# EAGLE design Main.autotest (EAGLE 7.6.0)
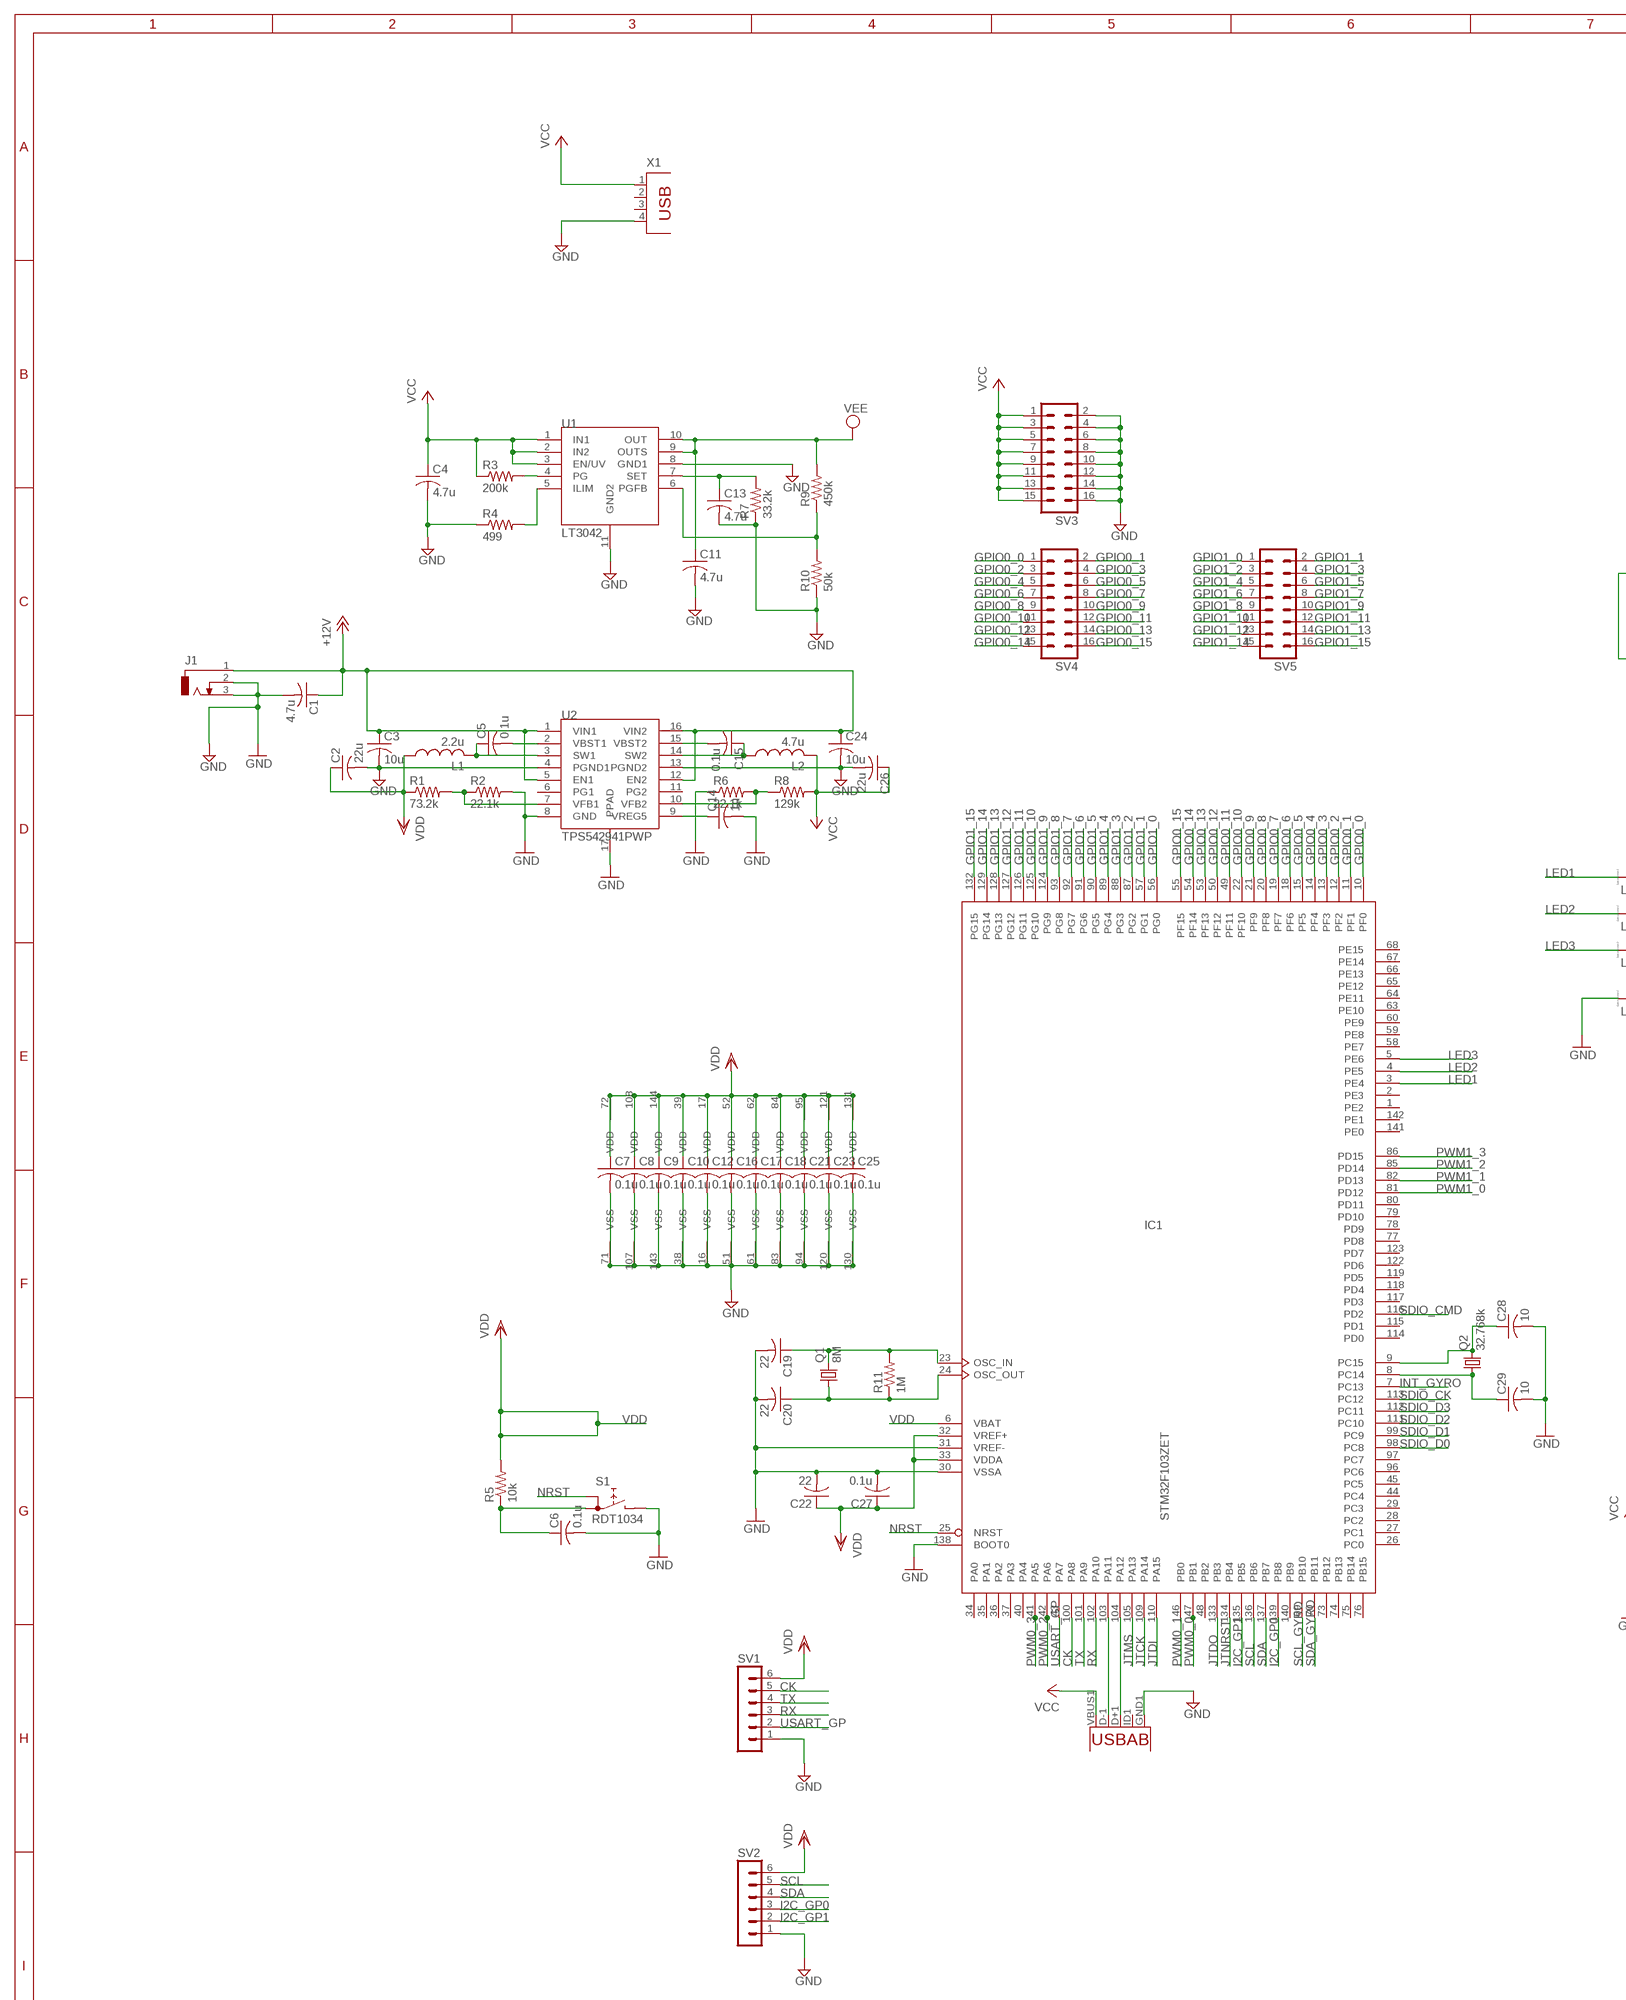
[diagram p0: schematic, sheet 1, part 1 of 2]
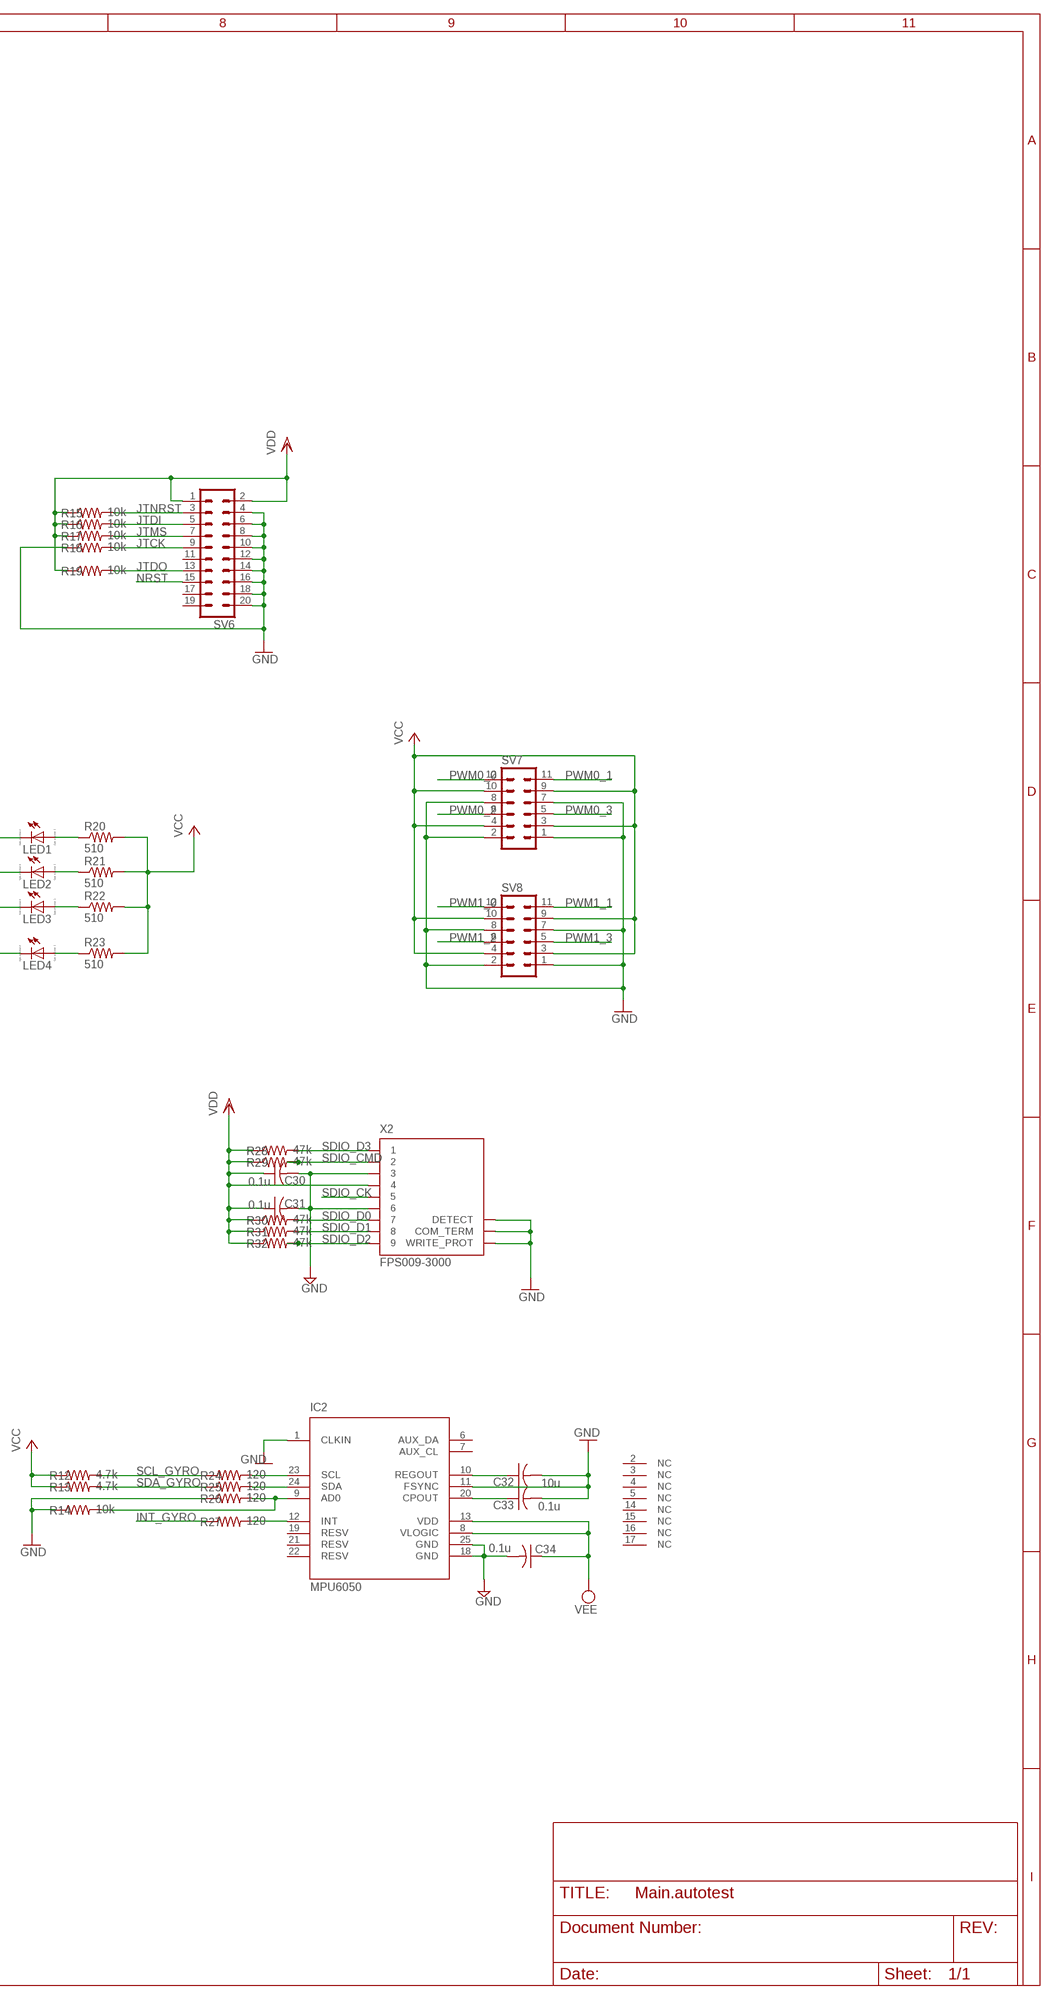
[diagram p1: schematic, sheet 1, part 2 of 2]

## Parts
C1  4.7u  C-USC1206  [C1206]
C2  22u  C-USC0603  [C0603]
C3  10u  C-USC0603  [C0603]
C4  4.7u  C-USC0603  [C0603]
C5  0.1u  C-USC0603  [C0603]
C6  0.1u  C-USC0603  [C0603]
C7  0.1u  C-USC0603  [C0603]
C8  0.1u  C-USC0603  [C0603]
C9  0.1u  C-USC0603  [C0603]
C10  0.1u  C-USC0603  [C0603]
C11  4.7u  C-USC0603  [C0603]
C12  0.1u  C-USC0603  [C0603]
C13  4.7u  C-USC0603  [C0603]
C14  1u  C-USC0603  [C0603]
C15  0.1u  C-USC0603  [C0603]
C16  0.1u  C-USC0603  [C0603]
C17  0.1u  C-USC0603  [C0603]
C18  0.1u  C-USC0603  [C0603]
C19  22  C-USC0603  [C0603]
C20  22  C-USC0603  [C0603]
C21  0.1u  C-USC0603  [C0603]
C22  22  C-USC0603  [C0603]
C23  0.1u  C-USC0603  [C0603]
C24  10u  C-USC0603  [C0603]
C25  0.1u  C-USC0603  [C0603]
C26  22u  C-USC0603  [C0603]
C27  0.1u  C-USC0603  [C0603]
C28  10  C-USC0603  [C0603]
C29  10  C-USC0603  [C0603]
C30  0.1u  C-USC0603  [C0603]
C31  0.1u  C-USC0603  [C0603]
C32  10u  C-USC0603  [C0603]
C33  0.1u  C-USC0603  [C0603]
C34  0.1u  C-USC0603  [C0603]
IC1  STM32F103ZET  [LQFP144]
IC2  MPU6050  [QFN50P400X400X95-25T265X275N]
J1  DCJ0303  [DCJ0303]
L1  2.2u  L-USL1812  [L1812]
L2  4.7u  L-USL1812  [L1812]
LED1  LED_E  [LED_1206]
LED2  LED_E  [LED_1206]
LED3  LED_E  [LED_1206]
LED4  LED_E  [LED_1206]
Q1  8M  CRYSTALHC49UP  [HC49UP]
Q2  32.768k  CRYSTALHC49UP  [HC49UP]
R1  73.2k  R-US_R1206  [R1206]
R2  22.1k  R-US_R1206  [R1206]
R3  200k  R-US_R0603  [R0603]
R4  499  R-US_R0603  [R0603]
R5  10k  R-US_R0603  [R0603]
R6  22.1k  R-US_R1206  [R1206]
R7  33.2k  R-US_R0603  [R0603]
R8  129k  R-US_R1206  [R1206]
R9  450k  R-US_R0603  [R0603]
R10  50k  R-US_R0603  [R0603]
R11  1M  R-US_R0603  [R0603]
R12  4.7k  R-US_R0603  [R0603]
R13  4.7k  R-US_R0603  [R0603]
R14  10k  R-US_R0603  [R0603]
R15  10k  R-US_R0603  [R0603]
R16  10k  R-US_R0603  [R0603]
R17  10k  R-US_R0603  [R0603]
R18  10k  R-US_R0603  [R0603]
R19  10k  R-US_R0603  [R0603]
R20  510  R-US_R0603  [R0603]
R21  510  R-US_R0603  [R0603]
R22  510  R-US_R0603  [R0603]
R23  510  R-US_R0603  [R0603]
R24  120  R-US_R0603  [R0603]
R25  120  R-US_R0603  [R0603]
R26  120  R-US_R0603  [R0603]
R27  120  R-US_R0603  [R0603]
R28  47k  R-US_R0603  [R0603]
R29  47k  R-US_R0603  [R0603]
R30  47k  R-US_R0603  [R0603]
R31  47k  R-US_R0603  [R0603]
R32  47k  R-US_R0603  [R0603]
S1  RDT1034  [RDT1034]
SV1  MA06-1  [MA06-1]
SV2  MA06-1  [MA06-1]
SV3  MA08-2  [MA08-2]
SV4  MA08-2  [MA08-2]
SV5  MA08-2  [MA08-2]
SV6  MA10-2  [MA10-2]
SV7  MA06-2  [MA06-2]
SV8  MA06-2  [MA06-2]
U1  LT3042  [LT3042]
U2  TPS542941PWP  [HTSSOP16]
U3  USB""  [USB-MICRO-SMD]
X1  PN87520  [PN87520]
X2  FPS009-3000  [FPS009-3000]

## Nets
+12V: C1.1 C3.1 C24.1 J1.1 U2.1(VIN1) U2.5(EN1) U2.12(EN2) U2.16(VIN2)
CK: IC1.100(PA8) SV1.5
GND: C1.2 C2.2 C3.2 C4.2 C6.2 C7.2 C8.2 C9.2 C10.2 C11.2 C12.2 C13.2 C14.2 C16.2 C17.2 C18.2 C19.2 C20.2 C21.2 C22.2 C23.2 C24.2 C25.2 C26.2 C27.2 C28.2 C29.2 C30.2 C31.2 C32.2 C33.2 C34.2 IC1.16(VSS) IC1.30(VSSA) IC1.31(VREF-) IC1.38(VSS) IC1.51(VSS) IC1.61(VSS) IC1.71(VSS) IC1.83(VSS) IC1.94(VSS) IC1.107(VSS) IC1.120(VSS) IC1.130(VSS) IC1.138(BOOT0) IC1.143(VSS) IC2.1(CLKIN) IC2.11(FSYNC) IC2.18(GND) IC2.25(GND) J1.2 J1.3 LED4.C R2.2 R4.1 R6.1 R7.1 R10.1 R14.1 R18.1 R26.1 S1.B SV1.1 SV2.1 SV3.2 SV3.4 SV3.6 SV3.8 SV3.10 SV3.12 SV3.14 SV3.16 SV6.4 SV6.6 SV6.8 SV6.10 SV6.12 SV6.14 SV6.16 SV6.18 SV6.20 SV7.1 SV7.2 SV7.7 SV7.8 SV8.1 SV8.2 SV8.7 SV8.8 U1.8(GND1) U1.11(GND2) U2.4(PGND1) U2.8(GND) U2.13(PGND2) U2.17(PPAD) U3.GND1(GND) X1.4 X2.3 X2.6 X2.COM_TERM X2.DETECT X2.WRITE_PROT
GPIO0_0: IC1.10(PF0) SV4.1
GPIO0_1: IC1.11(PF1) SV4.2
GPIO0_2: IC1.12(PF2) SV4.3
GPIO0_3: IC1.13(PF3) SV4.4
GPIO0_4: IC1.14(PF4) SV4.5
GPIO0_5: IC1.15(PF5) SV4.6
GPIO0_6: IC1.18(PF6) SV4.7
GPIO0_7: IC1.19(PF7) SV4.8
GPIO0_8: IC1.20(PF8) SV4.9
GPIO0_9: IC1.21(PF9) SV4.10
GPIO0_10: IC1.22(PF10) SV4.11
GPIO0_11: IC1.49(PF11) SV4.12
GPIO0_12: IC1.50(PF12) SV4.13
GPIO0_13: IC1.53(PF13) SV4.14
GPIO0_14: IC1.54(PF14) SV4.15
GPIO0_15: IC1.55(PF15) SV4.16
GPIO1_0: IC1.56(PG0) SV5.1
GPIO1_1: IC1.57(PG1) SV5.2
GPIO1_2: IC1.87(PG2) SV5.3
GPIO1_3: IC1.88(PG3) SV5.4
GPIO1_4: IC1.89(PG4) SV5.5
GPIO1_5: IC1.90(PG5) SV5.6
GPIO1_6: IC1.91(PG6) SV5.7
GPIO1_7: IC1.92(PG7) SV5.8
GPIO1_8: IC1.93(PG8) SV5.9
GPIO1_9: IC1.124(PG9) SV5.10
GPIO1_10: IC1.125(PG10) SV5.11
GPIO1_11: IC1.126(PG11) SV5.12
GPIO1_12: IC1.127(PG12) SV5.13
GPIO1_13: IC1.128(PG13) SV5.14
GPIO1_14: IC1.129(PG14) SV5.15
GPIO1_15: IC1.132(PG15) SV5.16
I2C_GP0: IC1.139(PB8) SV2.3
I2C_GP1: IC1.135(PB5) SV2.2
INT_GYRO: IC1.7(PC13) R27.1
JTCK: IC1.109(PA14) R18.2 SV6.9
JTDI: IC1.110(PA15) R16.2 SV6.5
JTDO: IC1.133(PB3) R19.2 SV6.13
JTMS: IC1.105(PA13) R17.2 SV6.7
JTNRST: IC1.134(PB4) R15.2 SV6.3
LED1: IC1.3(PE4) LED1.C
LED2: IC1.4(PE5) LED2.C
LED3: IC1.5(PE6) LED3.C
N$1: C19.1 IC1.23(OSC_IN) Q1.2 R11.2
N$2: C20.1 IC1.24(OSC_OUT) Q1.1 R11.1
N$3: IC1.103(PA11) U3.D-1(D-)
N$4: C29.1 IC1.8(PC14) Q2.1
N$5: C28.1 IC1.9(PC15) Q2.2
N$6: IC1.104(PA12) U3.D+1(D+)
N$7: C6.1 R5.1 S1.A1
N$8: LED4.A R23.1
N$9: LED1.A R20.1
N$10: IC2.23(SCL) R24.2
N$12: IC2.24(SDA) R25.2
N$13: LED2.A R21.1
N$14: C5.2 U2.2(VBST1)
N$15: IC2.12(INT) R27.2
N$16: C32.1 IC2.10(REGOUT)
N$17: C33.1 IC2.20(CPOUT)
N$18: IC2.9(AD0) R14.2 R26.2
N$19: LED3.A R22.1
N$20: C15.2 U2.15(VBST2)
N$21: C5.1 L1.2 U2.3(SW1)
N$22: R3.2 U1.4(PG)
N$23: C15.1 L2.1 U2.14(SW2)
N$24: R4.2 U1.5(ILIM)
N$25: R9.1 R10.2 U1.6(PGFB)
N$26: R1.2 R2.1 U2.7(VFB1)
N$27: C13.1 R7.2 U1.7(SET)
N$28: R6.2 R8.1 U2.10(VFB2)
N$30: C14.1 U2.9(VREG5)
NRST: IC1.25(NRST) S1.A SV6.15
PWM0_0: IC1.47(PB1) SV7.12
PWM0_1: IC1.46(PB0) SV7.11
PWM0_2: IC1.42(PA6) SV7.6
PWM0_3: IC1.41(PA5) SV7.5
PWM1_0: IC1.81(PD12) SV8.12
PWM1_1: IC1.82(PD13) SV8.11
PWM1_2: IC1.85(PD14) SV8.6
PWM1_3: IC1.86(PD15) SV8.5
RX: IC1.102(PA10) SV1.3
SCL: IC1.136(PB6) SV2.5
SCL_GYRO: IC1.69(PB10) R12.2 R24.1
SDA: IC1.137(PB7) SV2.4
SDA_GYRO: IC1.70(PB11) R13.2 R25.1
SDIO_CK: IC1.113(PC12) X2.5
SDIO_CMD: IC1.116(PD2) R29.2 X2.2
SDIO_D0: IC1.98(PC8) R30.2 X2.7
SDIO_D1: IC1.99(PC9) R31.2 X2.8
SDIO_D2: IC1.111(PC10) R32.2 X2.9
SDIO_D3: IC1.112(PC11) R28.2 X2.1
TX: IC1.101(PA9) SV1.4
USART_GP: IC1.43(PA7) SV1.2
VCC: C4.1 C26.1 L2.2 R3.1 R8.2 R12.1 R13.1 R20.2 R21.2 R22.2 R23.2 SV3.1 SV3.3 SV3.5 SV3.7 SV3.9 SV3.11 SV3.13 SV3.15 SV7.3 SV7.4 SV7.9 SV7.10 SV8.3 SV8.4 SV8.9 SV8.10 U1.1(IN1) U1.2(IN2) U1.3(EN/UV) U3.VBUS1(VBUS) X1.1
VDD: C2.1 C7.1 C8.1 C9.1 C10.1 C12.1 C16.1 C17.1 C18.1 C21.1 C22.1 C23.1 C25.1 C27.1 C30.1 C31.1 IC1.6(VBAT) IC1.17(VDD) IC1.32(VREF+) IC1.33(VDDA) IC1.39(VDD) IC1.52(VDD) IC1.62(VDD) IC1.72(VDD) IC1.84(VDD) IC1.95(VDD) IC1.108(VDD) IC1.121(VDD) IC1.131(VDD) IC1.144(VDD) L1.1 R1.1 R5.2 R15.1 R16.1 R17.1 R19.1 R28.1 R29.1 R30.1 R31.1 R32.1 SV1.6 SV2.6 SV6.1 SV6.2 X2.4
VEE: C11.1 C34.1 IC2.8(VLOGIC) IC2.13(VDD) R9.2 U1.9(OUTS) U1.10(OUT)
Unconnected: IC1.1(PE2) IC1.2(PE3) IC1.26(PC0) IC1.27(PC1) IC1.28(PC2) IC1.29(PC3) IC1.34(PA0) IC1.35(PA1) IC1.36(PA2) IC1.37(PA3) IC1.40(PA4) IC1.44(PC4) IC1.45(PC5) IC1.48(PB2) IC1.58(PE7) IC1.59(PE8) IC1.60(PE9) IC1.63(PE10) IC1.64(PE11) IC1.65(PE12) IC1.66(PE13) IC1.67(PE14) IC1.68(PE15) IC1.73(PB12) IC1.74(PB13) IC1.75(PB14) IC1.76(PB15) IC1.77(PD8) IC1.78(PD9) IC1.79(PD10) IC1.80(PD11) IC1.96(PC6) IC1.97(PC7) IC1.114(PD0) IC1.115(PD1) IC1.117(PD3) IC1.118(PD4) IC1.119(PD5) IC1.122(PD6) IC1.123(PD7) IC1.140(PB9) IC1.141(PE0) IC1.142(PE1) IC2.2(NC) IC2.3(NC) IC2.4(NC) IC2.5(NC) IC2.6(AUX_DA) IC2.7(AUX_CL) IC2.14(NC) IC2.15(NC) IC2.16(NC) IC2.17(NC) IC2.19(RESV) IC2.21(RESV) IC2.22(RESV) SV6.11 SV6.17 SV6.19 U2.6(PG1) U2.11(PG2) U3.ID1(USBID) X1.2 X1.3

## Library data of the parts
C1-C34 = rcl:C-US: CAPACITOR, American symbol
IC1 = micro-stm_v3:STM32F103Z*T: ARM 32-bit Cortex™-M3 CPU 72 MHz maximum frequency 256 to 1024 Kbytes of Flash memory 48 to 96 kbytes of SRAM 112 GPIOs 2.0 to 3.6 V application supply
IC2 = invensense:MPU6050: The triple-axis MEMS gyroscope
J1 = con-jack:DCJ0303: DC POWER JACK Source: DCJ0303.pdf; OC_FARNELL: unknown; OC_NEWARK: unknown
L1 L2 = rcl:L-US: INDUCTOR, American symbol
LED1-LED4 = eagle-ltspice:LED_E: LED Source: http://www.osram.convergy.de Source: www.luxeon.com Source: www.kingbright.com; SPICEMODEL: NONE; SPICEPREFIX: D; SPICETYPE: diode
Q1 Q2 = crystal:CRYSTAL: CRYSTAL; OC_FARNELL: unknown; OC_NEWARK: unknown
R1-R14 R20-R32 = rcl:R-US_: RESISTOR, American symbol
R15-R19 = resistor:R-US_: RESISTOR, American symbol
S1 = switch:RDT1034: PUSH SWITCH www.radiohm.com
SV1 SV2 = con-lstb:MA06-1: PIN HEADER; OC_FARNELL: unknown; OC_NEWARK: unknown
SV3-SV5 = con-lstb:MA08-2: PIN HEADER; OC_FARNELL: unknown; OC_NEWARK: unknown
SV6 = con-lstb:MA10-2: PIN HEADER; OC_FARNELL: unknown; OC_NEWARK: unknown
SV7 SV8 = con-lstb:MA06-2: PIN HEADER; OC_FARNELL: unknown; OC_NEWARK: unknown
U1 = LT3042:LT3042
U2 = TPS542941:TPS542941PWP
U3 = MicroUSB:USB: This is a USB AB connector that is compatible with USB OTG. i.e. this connector can serve as a host or device
X1 = con-berg:PN87520: BERG USB connector; OC_FARNELL: unknown; OC_NEWARK: unknown
X2 = con-yamaichi:FPS009-300*: SD Card and MMC Reader (Manual Insertion) Source: http://www.yamaichi.de/pdf/c_fps009_3000.pdf; OC_FARNELL: unknown; OC_NEWARK: unknown

## Board
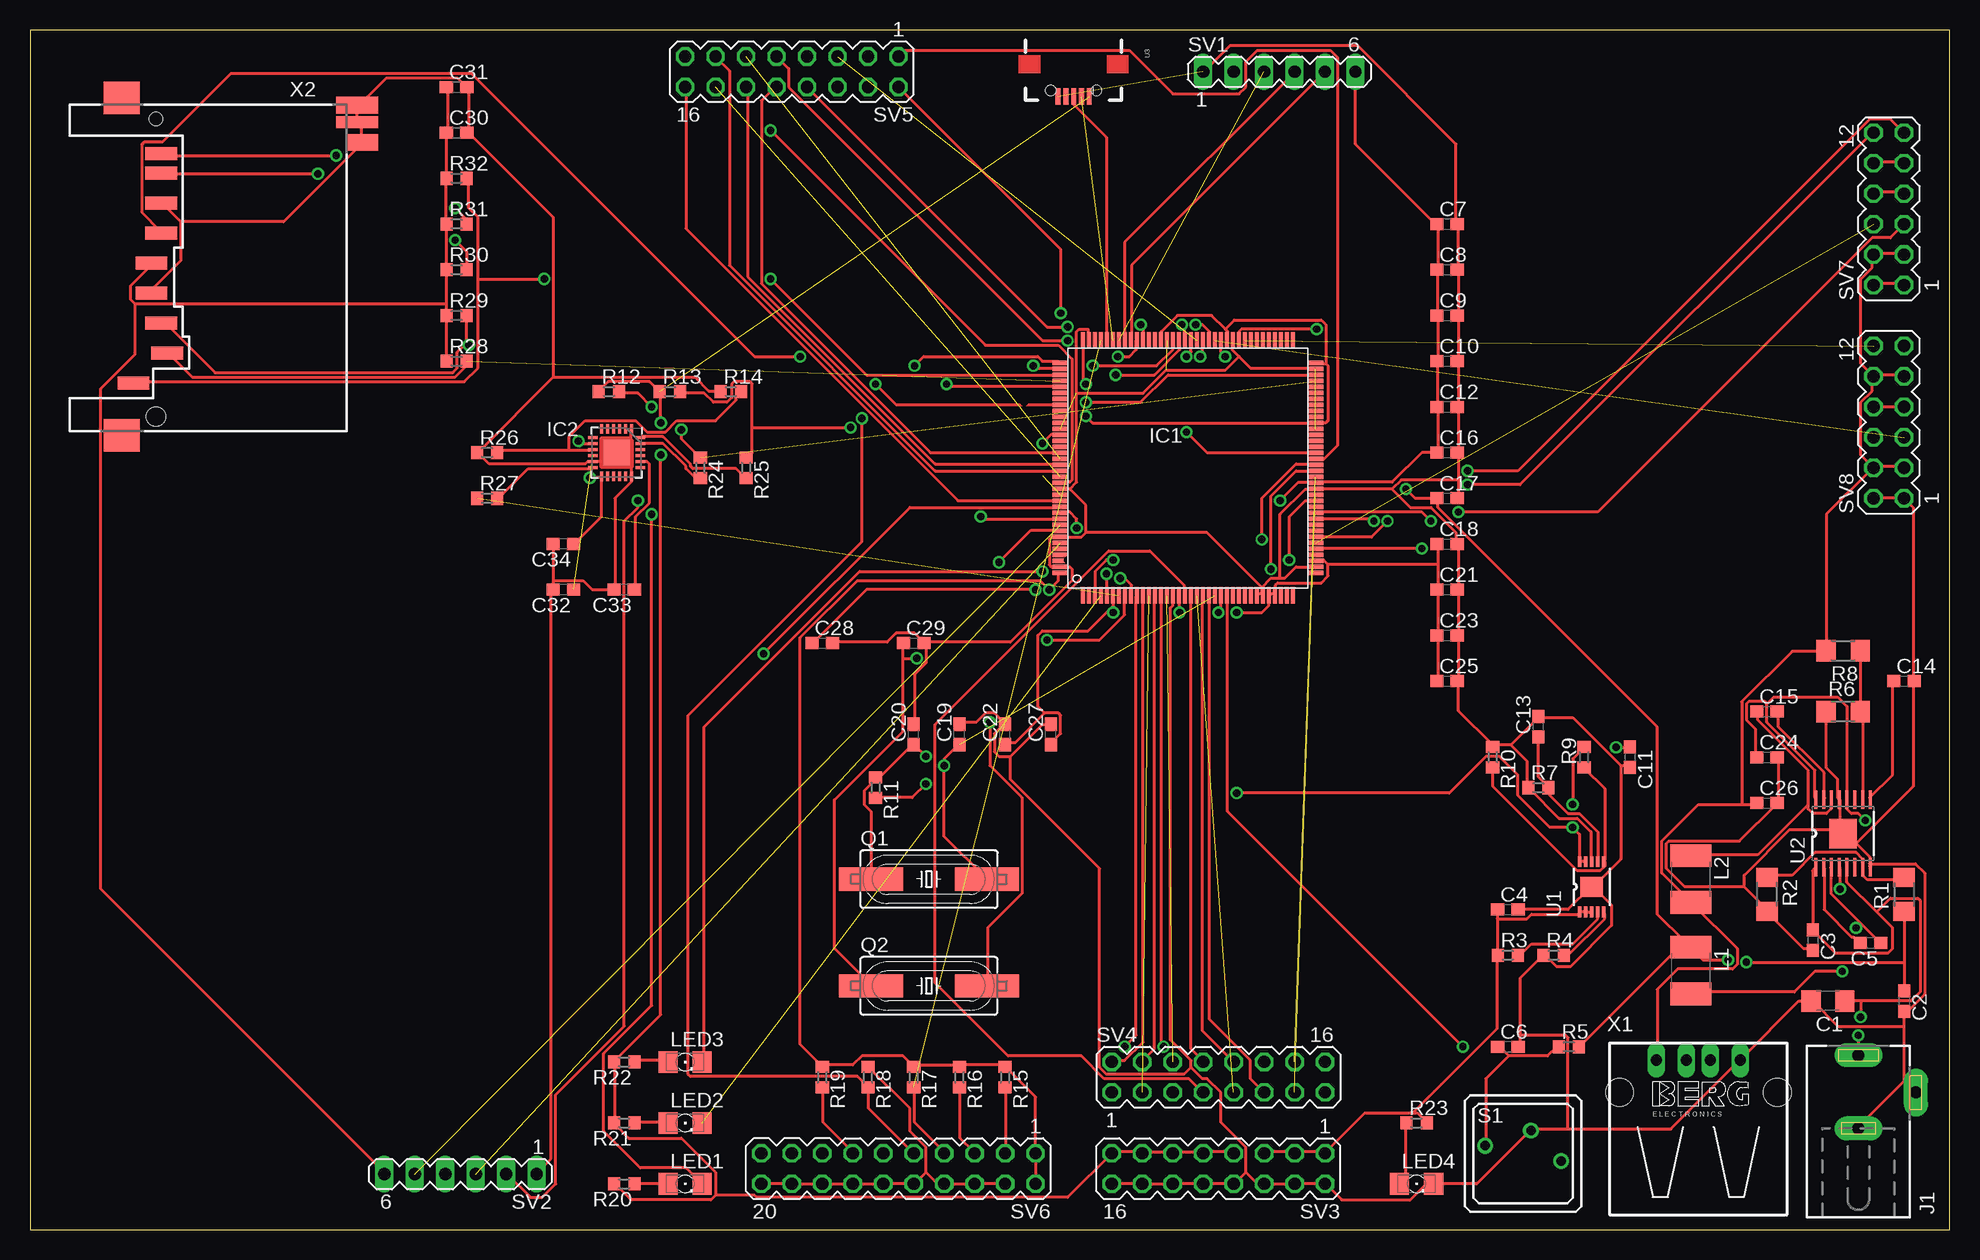
[diagram p2: board, top side]
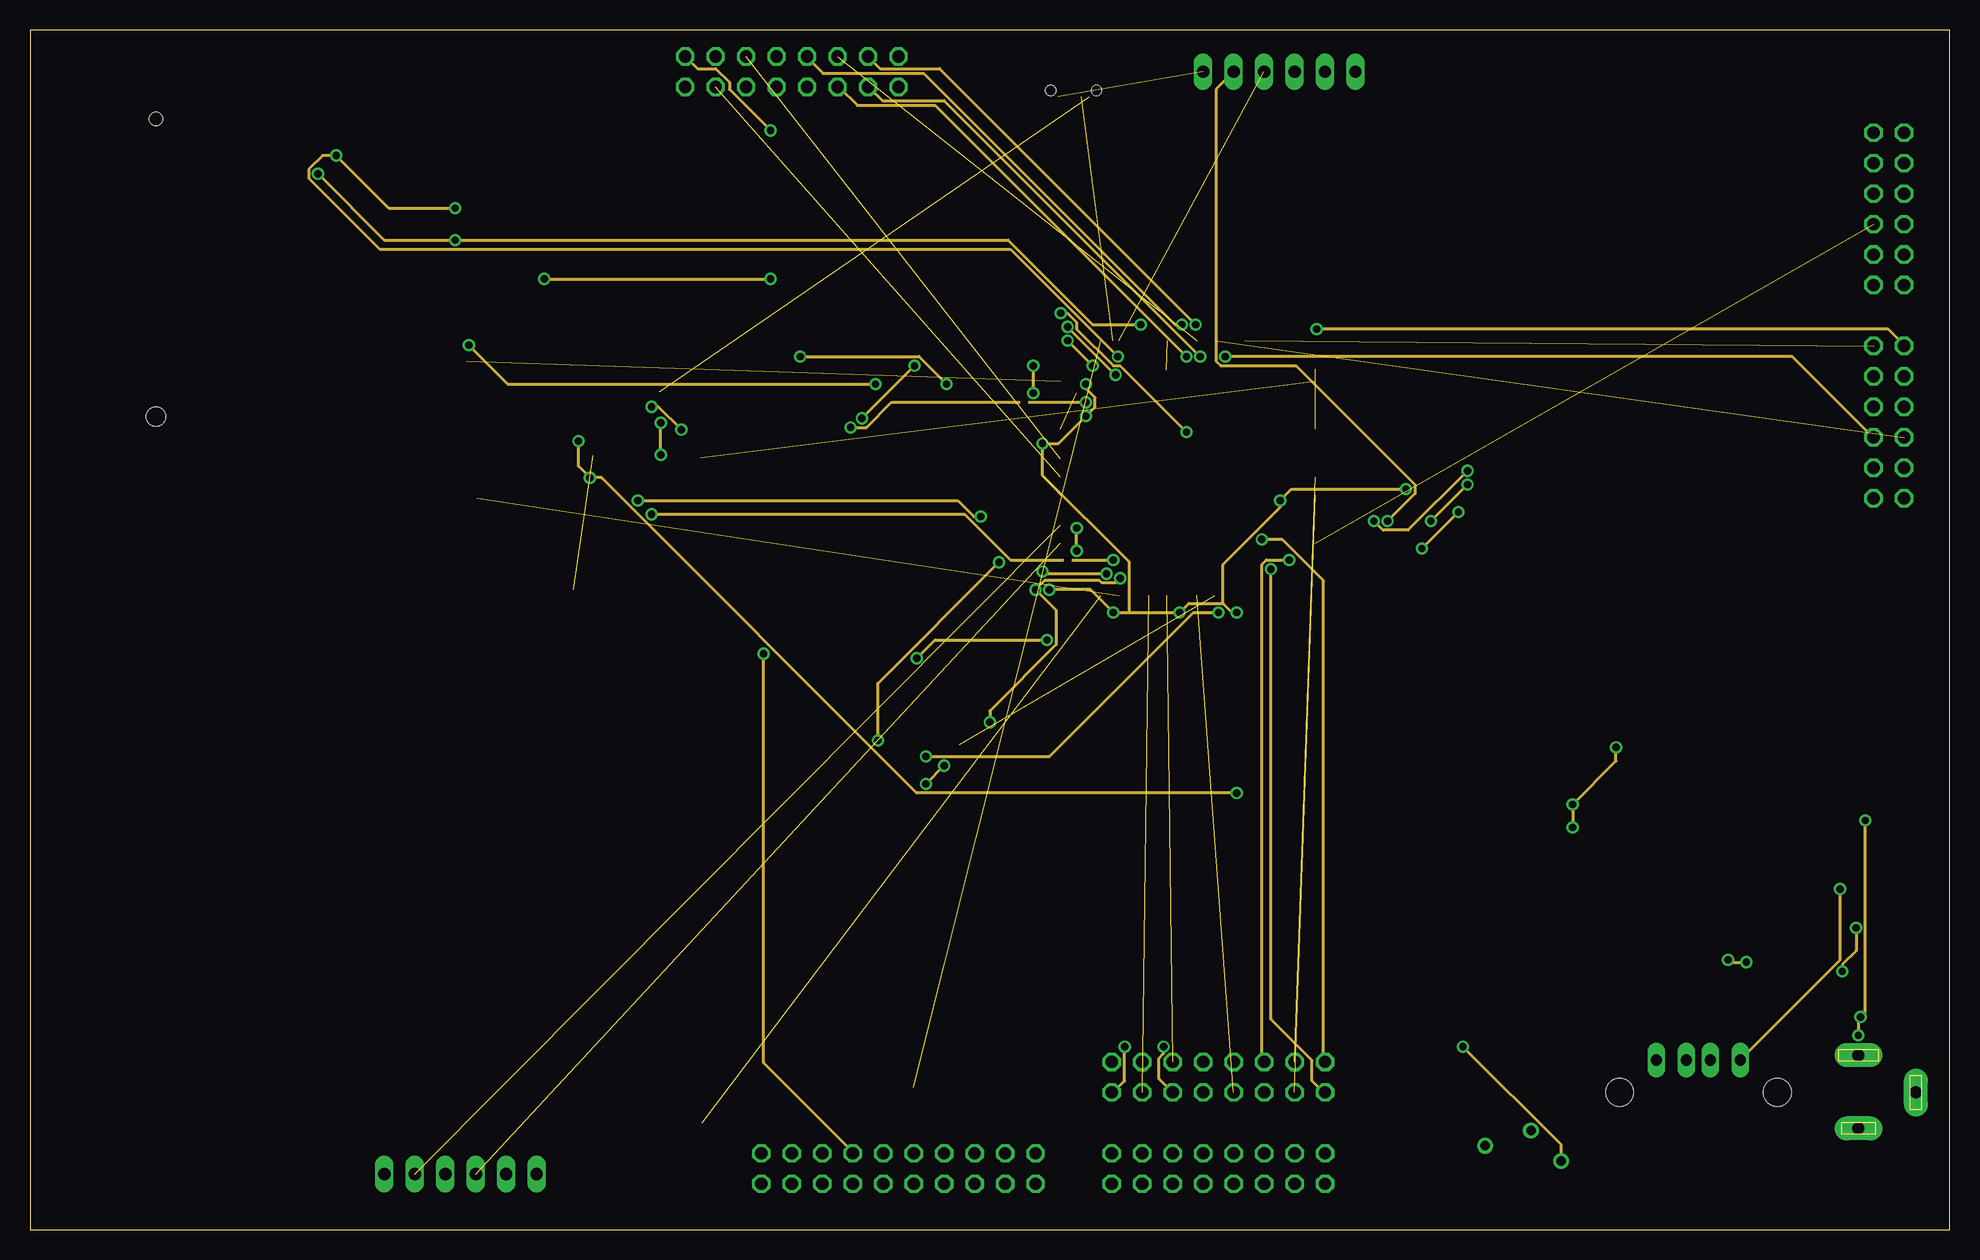
[diagram p3: board, inner layer $GND]
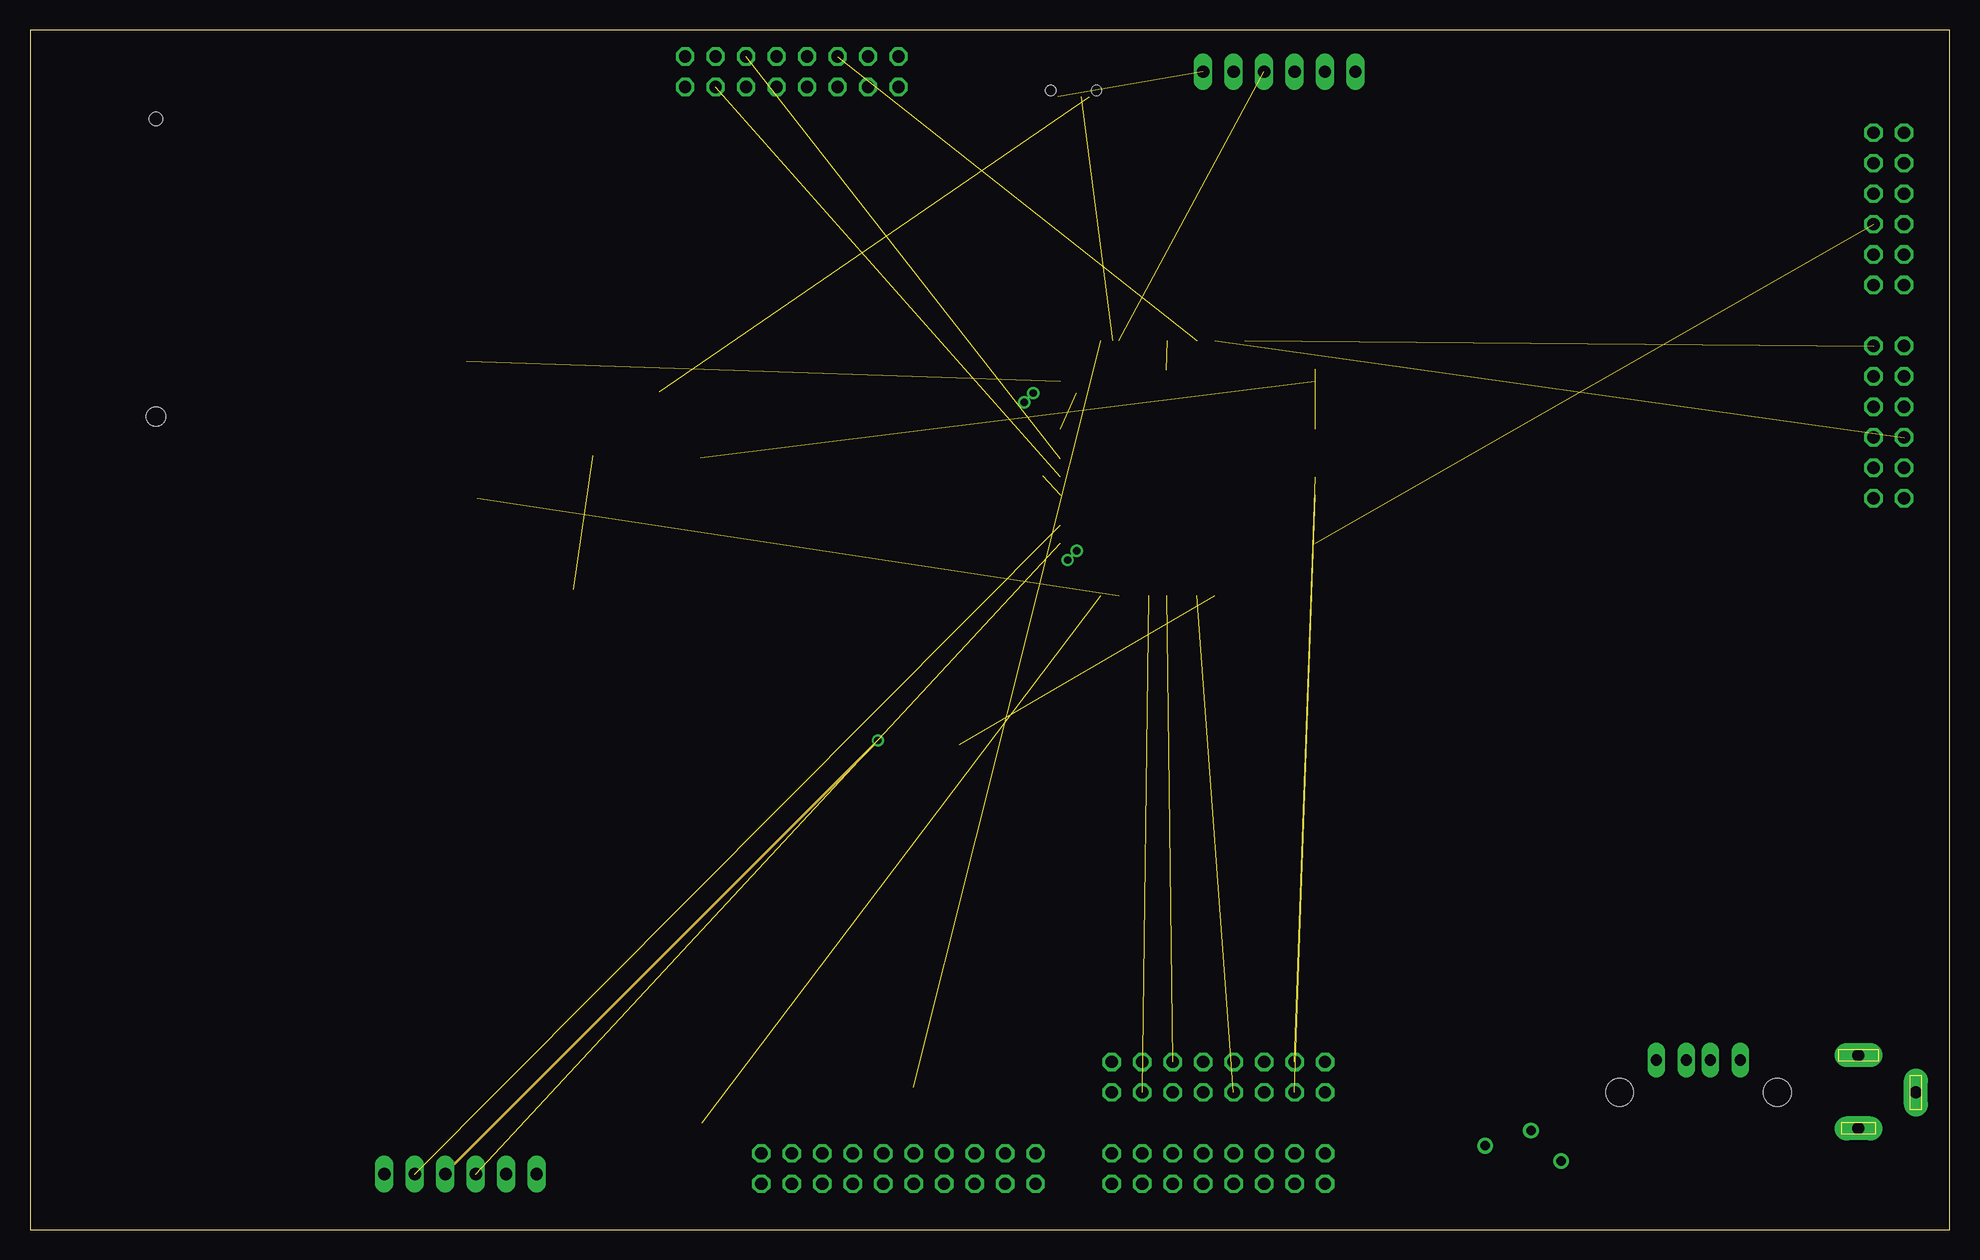
[diagram p4: board, inner layer $VDD]
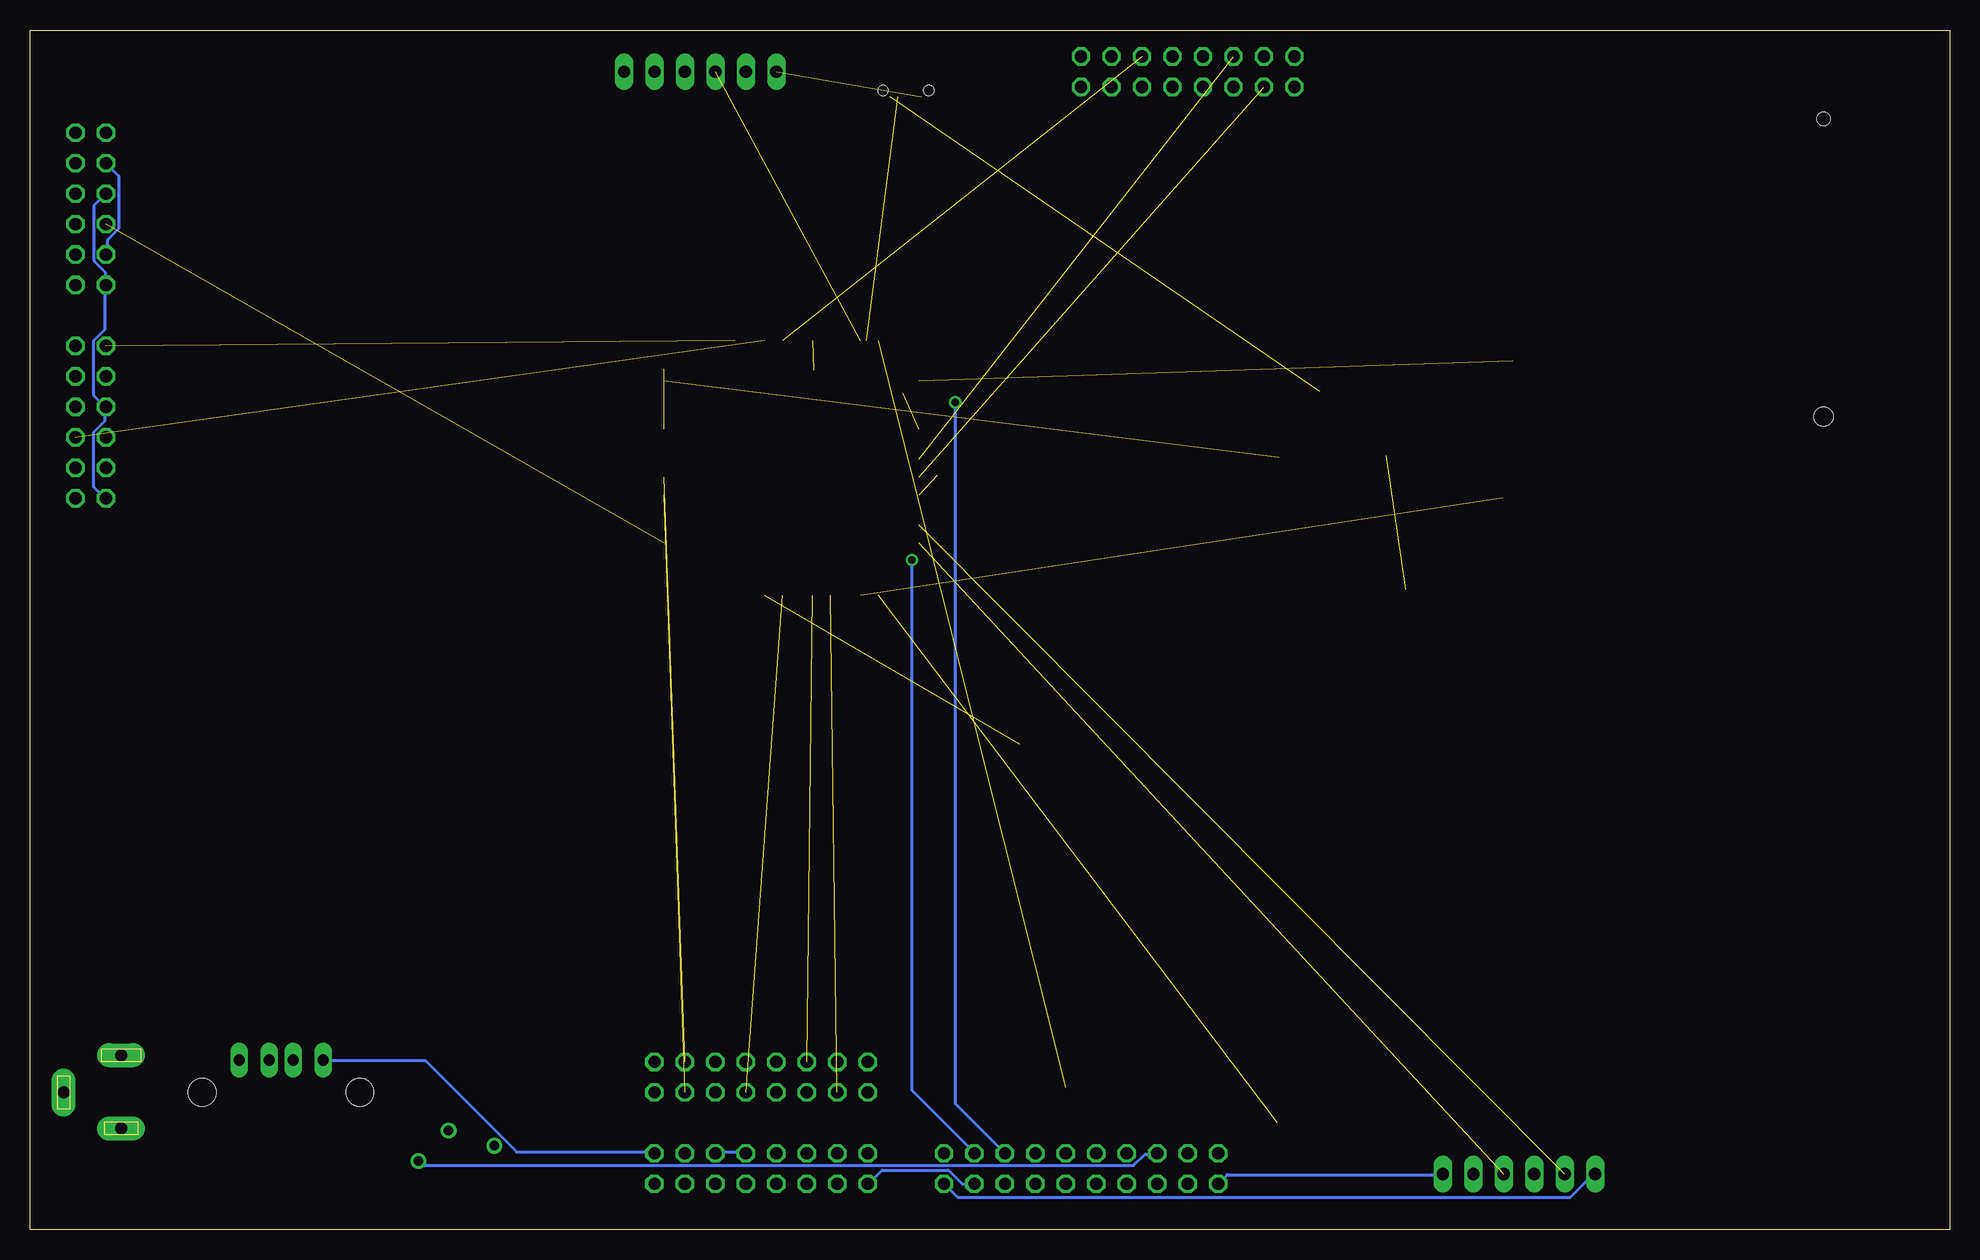
[diagram p5: board, bottom side, seen from below]

Size 160 x 100 mm. Coordinates in mm from the lower left corner, seen from the top.
Outline: 0,0 160,0 160,100 0,100 0,0
Copper layers [2:1*(2*15)*16:15]: Top 0.035mm / dielectric 0.5mm / $GND 0.035mm / dielectric 0.5mm / $VDD 0.035mm / dielectric 0.5mm / Bottom 0.035mm
Design rules "default *": minimum track width 10mil, minimum drill 24mil, track to track 5mil, track to pad 5mil, pad to pad 5mil, via to via 5mil, smd to smd 5mil, copper to edge 40mil, drill to drill 8mil, minimum pad ring 10mil, minimum via ring 8mil, stop-mask expansion 4mil, vias tented up to drill 0mil, thermal gap 10mil

### Footprints (pad centres in the part's own frame; a part is rotated, then mirrored left to right if it is on the bottom)
C1206 = smd 1.6 x 1.8: 1 -1.4,0; 2 1.4,0
C0603 = smd 1.1 x 1: 1 -0.85,0; 2 0.85,0
LQFP144 = smd 0.35 x 1.35: 1 -8.75,-10.625; 2 -8.25,-10.625; 3 -7.75,-10.625; 4 -7.25,-10.625; 5 -6.75,-10.625; 6 -6.25,-10.625; 7 -5.75,-10.625; 8 -5.25,-10.625; 9 -4.75,-10.625; 10 -4.25,-10.625; 11 -3.75,-10.625; 12 -3.25,-10.625; 13 -2.75,-10.62; 14 -2.25,-10.625; 15 -1.75,-10.625; 16 -1.25,-10.625; 17 -0.75,-10.625; 18 -0.25,-10.625; 19 0.25,-10.625; 20 0.75,-10.625; 21 1.25,-10.625; 22 1.75,-10.625; 23 2.25,-10.625; 24 2.75,-10.62; 25 3.25,-10.625; 26 3.75,-10.625; 27 4.25,-10.625; 28 4.75,-10.625; 29 5.25,-10.625; 30 5.75,-10.625; 31 6.25,-10.625; 32 6.75,-10.625; 33 7.25,-10.625; 34 7.75,-10.625; 35 8.25,-10.625; 36 8.75,-10.625; 73 8.75,10.625; 74 8.25,10.625; 75 7.75,10.625; 76 7.25,10.625; 77 6.75,10.625; 78 6.25,10.625; 79 5.75,10.625; 80 5.25,10.625; 81 4.75,10.625; 82 4.25,10.625; 83 3.75,10.625; 84 3.25,10.625; 85 2.75,10.625; 86 2.25,10.625; 87 1.75,10.625; 88 1.25,10.625; 89 0.75,10.625; 90 0.25,10.625; 91 -0.25,10.625; 92 -0.75,10.625; 93 -1.25,10.625; 94 -1.75,10.625; 95 -2.25,10.625; 96 -2.75,10.625; 97 -3.25,10.625; 98 -3.75,10.625; 99 -4.25,10.625; 100 -4.75,10.625; 101 -5.25,10.625; 102 -5.75,10.625; 103 -6.25,10.625; 104 -6.75,10.625; 105 -7.25,10.625; 106 -7.75,10.625; 107 -8.25,10.625; 108 -8.75,10.625 | smd 1.35 x 0.35: 37 10.625,-8.75; 38 10.625,-8.25; 39 10.625,-7.75; 40 10.625,-7.25; 41 10.625,-6.75; 42 10.625,-6.25; 43 10.625,-5.75; 44 10.625,-5.25; 45 10.625,-4.75; 46 10.625,-4.25; 47 10.625,-3.75; 48 10.625,-3.25; 49 10.625,-2.75; 50 10.625,-2.25; 51 10.625,-1.75; 52 10.625,-1.25; 53 10.625,-0.75; 54 10.625,-0.25; 55 10.625,0.25; 56 10.625,0.75; 57 10.625,1.25; 58 10.625,1.75; 59 10.625,2.25; 60 10.625,2.75; 61 10.625,3.25; 62 10.625,3.75; 63 10.625,4.25; 64 10.625,4.75; 65 10.625,5.25; 66 10.625,5.75; 67 10.625,6.25; 68 10.625,6.75; 69 10.625,7.25; 70 10.625,7.75; 71 10.625,8.25; 72 10.625,8.75; 109 -10.625,8.75; 110 -10.625,8.25; 111 -10.625,7.75; 112 -10.625,7.25; 113 -10.625,6.75; 114 -10.625,6.25; 115 -10.625,5.75; 116 -10.625,5.25; 117 -10.625,4.75; 118 -10.625,4.25; 119 -10.625,3.75; 120 -10.625,3.25; 121 -10.625,2.75; 122 -10.625,2.25; 123 -10.625,1.75; 124 -10.625,1.25; 125 -10.625,0.75; 126 -10.625,0.25; 127 -10.625,-0.25; 128 -10.625,-0.75; 129 -10.625,-1.25; 130 -10.625,-1.75; 131 -10.625,-2.25; 132 -10.625,-2.75; 133 -10.625,-3.25; 134 -10.625,-3.75; 135 -10.625,-4.25; 136 -10.625,-4.75; 137 -10.625,-5.25; 138 -10.625,-5.75; 139 -10.625,-6.25; 140 -10.625,-6.75; 141 -10.625,-7.25; 142 -10.625,-7.75; 143 -10.625,-8.25; 144 -10.625,-8.75
QFN50P400X400X95-25T265X275N = smd 0.26 x 0.79: 1 -1.25,-1.97; 2 -0.75,-1.97; 3 -0.25,-1.97; 4 0.25,-1.97; 5 0.75,-1.97; 6 1.25,-1.97; 13 1.25,1.97; 14 0.75,1.97; 15 0.25,1.97; 16 -0.25,1.97; 17 -0.75,1.97; 18 -1.25,1.97 | smd 0.79 x 0.26: 7 1.97,-1.25; 8 1.97,-0.75; 9 1.97,-0.25; 10 1.97,0.25; 11 1.97,0.75; 12 1.97,1.25; 19 -1.97,1.25; 20 -1.97,0.75; 21 -1.97,0.25; 22 -1.97,-0.25; 23 -1.97,-0.75; 24 -1.97,-1.25 | smd 2.15 x 2.05: 25 0,0
DCJ0303 = drill 1 pad 2 long: 1 0,3.1; 2 4.8,0; 3 0,-3
L1812 = smd 1.9 x 3.4: 1 -1.95,0; 2 1.95,0
LED_1206 = smd 1.6 x 1.803: A -1.422,0; C 1.422,0
HC49UP = smd 5.334 x 1.93: 1 -4.826,0; 2 4.826,0
R1206 = smd 1.6 x 1.803: 1 -1.422,0; 2 1.422,0
R0603 = smd 1 x 1.1: 1 -0.85,0; 2 0.85,0
RDT1034 = drill 0.8: A 3.175,-0.635; A1 -3.175,0.635; B 0.65,1.9
MA06-1 = drill 1.016 long: 1 -6.35,0; 2 -3.81,0; 3 -1.27,0; 4 1.27,0; 5 3.81,0; 6 6.35,0
MA08-2 = drill 1.016 octagon: 1 -8.89,-1.27; 2 -8.89,1.27; 3 -6.35,-1.27; 4 -6.35,1.27; 5 -3.81,-1.27; 6 -3.81,1.27; 7 -1.27,-1.27; 8 -1.27,1.27; 9 1.27,-1.27; 10 1.27,1.27; 11 3.81,-1.27; 12 3.81,1.27; 13 6.35,-1.27; 14 6.35,1.27; 15 8.89,-1.27; 16 8.89,1.27
MA10-2 = drill 1.016 octagon: 1 -11.43,-1.27; 2 -11.43,1.27; 3 -8.89,-1.27; 4 -8.89,1.27; 5 -6.35,-1.27; 6 -6.35,1.27; 7 -3.81,-1.27; 8 -3.81,1.27; 9 -1.27,-1.27; 10 -1.27,1.27; 11 1.27,-1.27; 12 1.27,1.27; 13 3.81,-1.27; 14 3.81,1.27; 15 6.35,-1.27; 16 6.35,1.27; 17 8.89,-1.27; 18 8.89,1.27; 19 11.43,-1.27; 20 11.43,1.27
MA06-2 = drill 1.016 octagon: 1 -6.35,-1.27; 2 -6.35,1.27; 3 -3.81,-1.27; 4 -3.81,1.27; 5 -1.27,-1.27; 6 -1.27,1.27; 7 1.27,-1.27; 8 1.27,1.27; 9 3.81,-1.27; 10 3.81,1.27; 11 6.35,-1.27; 12 6.35,1.27
LT3042 = smd 0.305 x 0.889: 1 -1,-2.1; 2 -0.5,-2.1; 3 0,-2.1; 4 0.5,-2.1; 5 1,-2.1; 6 1,2.1; 7 0.5,2.1; 8 0,2.1; 9 -0.5,2.1; 10 -1,2.1 | smd 1.88 x 1.68: 11 0,0
HTSSOP16 = smd 1.55 x 0.25: 1 -2.8,2.275; 2 -2.8,1.625; 3 -2.8,0.975; 4 -2.8,0.325; 5 -2.8,-0.325; 6 -2.8,-0.975; 7 -2.8,-1.625; 8 -2.8,-2.275; 9 2.8,-2.275; 10 2.8,-1.625; 11 2.8,-0.975; 12 2.8,-0.325; 13 2.8,0.325; 14 2.8,0.975; 15 2.8,1.625; 16 2.8,2.275 | smd 2.46 x 2.31: 17 0,0
USB-MICRO-SMD = smd 1.4 x 0.4: D+1 2.7,0; D-1 2.7,0.65; GND1 2.7,-1.3; ID1 2.7,-0.65; VBUS1 2.7,1.3 | hole 0.85: 2.2,1.9; 2.2,-1.9
PN87520 = drill 0.95 long: 1 -3.5,2.71; 2 -1,2.71; 3 1,2.71; 4 3.5,2.71 | hole 2.3: -6.57,0; 6.57,0
FPS009-3000 = smd 2.65 x 1.1: 1 -0.915,-5.3; 2 -0.415,-7.8; 3 0.385,-10.3; 4 0.385,-12.8; 5 -0.415,-15.3; 6 -0.415,-17.8; 7 -0.415,-20.3; 8 -0.415,-21.925; 9 1.885,-2.8 | smd 3.5 x 1: COM_TERM -16.75,-24.55 | smd 2.5 x 1.4: DETECT -17.25,-22.85 | smd 3 x 2.7: M1 2.85,1.55; M2 2.85,-26.55 | smd 3.5 x 1.4: WRITE_PROT -16.75,-25.95 | hole 1.6: 0,0 | hole 1.1: 0,-24.8

### Placement (x,y rotation side)
C1  149.86,19.05 180 top
C2  156.21,19.05 270 top
C3  148.59,24.13 270 top
C4  123.19,26.67 0 top
C5  153.42,23.88 180 top
C6  123.19,15.24 0 top
C7  118.11,83.82 0 top
C8  118.11,80.01 0 top
C9  118.11,76.2 0 top
C10  118.11,72.39 0 top
C11  133.35,39.37 270 top
C12  118.11,68.58 0 top
C13  125.73,41.91 90 top
C14  156.21,45.72 0 top
C15  144.78,43.18 0 top
C16  118.11,64.77 0 top
C17  118.11,60.96 0 top
C18  118.11,57.15 0 top
C19  77.47,41.27 90 top
C20  73.66,41.27 90 top
C21  118.11,53.34 0 top
C22  81.28,41.27 90 top
C23  118.11,49.53 0 top
C24  144.78,39.37 0 top
C25  118.11,45.72 0 top
C26  144.78,35.56 0 top
C27  85.09,41.27 90 top
C28  66.04,48.9 0 top
C29  73.66,48.9 0 top
C30  35.56,91.44 0 top
C31  35.56,95.25 0 top
C32  44.45,53.34 180 top
C33  49.53,53.34 180 top
C34  44.45,57.15 180 top
IC1  96.52,63.5 0 top
IC2  48.9,64.77 180 top
J1  152.4,11.43 0 top
L1  138.43,21.59 270 top
L2  138.43,29.21 270 top
LED1  54.61,3.81 0 top
LED2  54.61,8.89 0 top
LED3  54.61,13.97 0 top
LED4  115.57,3.81 0 top
Q1  74.93,29.21 0 top
Q2  74.93,20.32 0 top
R1  156.21,27.94 90 top
R2  144.78,27.94 270 top
R3  123.19,22.86 0 top
R4  127,22.86 0 top
R5  128.27,15.24 0 top
R6  151.13,43.18 0 top
R7  125.73,36.83 0 top
R8  151.13,48.26 180 top
R9  129.54,39.37 90 top
R10  121.92,39.37 270 top
R11  70.48,36.83 270 top
R12  48.26,69.85 0 top
R13  53.34,69.85 0 top
R14  58.42,69.85 0 top
R15  81.28,12.7 270 top
R16  77.47,12.7 270 top
R17  73.66,12.7 270 top
R18  69.85,12.7 270 top
R19  66.04,12.7 270 top
R20  49.53,3.81 180 top
R21  49.53,8.89 180 top
R22  49.53,13.97 180 top
R23  115.57,8.89 0 top
R24  55.88,63.5 270 top
R25  59.69,63.5 270 top
R26  38.1,64.77 0 top
R27  38.1,60.96 0 top
R28  35.56,72.39 0 top
R29  35.56,76.2 0 top
R30  35.56,80.01 0 top
R31  35.56,83.82 0 top
R32  35.56,87.63 0 top
S1  124.46,6.35 0 top
SV1  104.14,96.52 0 top
SV2  35.89,4.62 180 top
SV3  99.06,5.08 180 top
SV4  99.06,12.7 0 top
SV5  63.5,96.52 180 top
SV6  72.39,5.08 180 top
SV7  154.94,85.09 90 top
SV8  154.94,67.31 90 top
U1  130.18,28.57 0 top
U2  151.13,33.02 90 top
U3  87,97.16 270 top
X1  139.06,11.43 0 top
X2  10.52,67.77 180 top

### Tracks (layer width: path | path; a pad name or v marks a point on that pad's centre or on a via)
+12V  (via drill 0.61 layers 1-2)
  Top 0.254: 144.78,43.81 144.59,44.01 143.26,44.01 143.06,43.81 143.06,42.48 143.83,41.72 143.83,39.43 C24.1 | 144.78,43.81 144.78,42.29 148.78,38.29 148.78,36.01 U2.16 | 144.78,43.81 145.35,44.39 150.69,44.39 151.45,43.62 151.45,36.01 U2.12 151.45,35.05 151.83,34.67 152.4,34.67 v152.97,34.1 | U2.1 148.78,30.1 148.59,29.91 C3.1 148.59,24.96 150.5,23.05 154.88,23.05 155.26,23.43 155.26,25.15 153.92,26.48 | 153.92,26.48 151.45,28.96 151.45,30.1 U2.5 | 152.59,19.05 156.78,19.05 157.54,19.81 157.54,27.43 157.35,27.62 155.07,27.62 153.92,26.48 | 152.59,19.05 C1.1 | v152.4,16.19 J1.1 | 152.59,19.05 v152.59,17.72
  $GND 0.254: v152.4,16.19 152.4,17.53 v152.59,17.72 152.97,18.1 v152.97,34.1
CK
  Top 0.254: SV1.5 91.82,80.39 91.82,74.3 IC1.100
GND  (via drill 0.61 layers 1-2)  (4 unrouted)
  Top 0.254: C20.2 73.72,42.29 73.72,46.29 74.68,47.24 74.68,48.77 C29.2 | C28.2 67.06,48.96 71.44,48.96 72.2,49.72 73.72,49.72 74.49,48.96 C29.2 | 100.78,72.77 100.2,73.34 100.2,74.11 IC1.83 | 100.78,72.77 101.73,71.82 107.06,71.82 IC1.71 | 86.68,61.72 85.92,61.72 IC1.130 | 86.68,61.72 88.01,60.39 88.01,58.1 | 88.01,58.1 87.63,57.72 85.92,57.72 IC1.138 85.72,57.72 85.15,57.72 84.96,57.53 84.96,55.44 85.15,55.24 85.72,55.24 IC1.143 85.92,55.24 86.68,55.24 86.87,55.05 86.87,54.1 81.72,48.96 74.68,48.96 C29.2 | 87.25,69.72 87.25,62.29 86.68,61.72 | 87.25,69.72 87.25,74.87 87.44,75.06 88.2,75.06 88.2,74.3 IC1.107 | 100.78,72.77 99.63,71.63 94.68,71.63 92.77,69.72 87.25,69.72 | 119.06,49.53 119.06,45.72 | 119.06,53.34 119.06,57.15 C18.2 118.87,57.15 118.87,58.1 116.78,60.2 115.06,60.2 113.54,61.72 | 119.06,53.34 119.06,49.53 | 119.06,49.53 C23.2 | 119.06,53.34 C21.2 | U1.8 130.11,30.86 130.11,33.15 128.97,34.29 127.44,34.29 124.97,36.77 R7.1 124.78,36.96 124.78,39.05 123.44,40.39 | 124.21,16.19 124.21,20.95 126.11,22.86 R4.1 126.3,22.86 127.25,21.91 128.4,21.91 131.83,25.34 131.83,27.05 130.3,28.57 | 124.21,16.19 124.21,15.24 C6.2 | C4.2 128.21,26.67 130.11,28.57 U1.11 130.3,28.57 | 123.44,40.39 121.92,40.39 | 125.73,42.67 123.44,40.39 | 132.59,38.67 133.35,38.67 C11.2 | 132.59,38.67 128.59,42.67 125.73,42.67 | 125.73,42.67 C13.2 | 130.3,28.57 132.59,30.86 132.59,38.67 | 119.06,45.72 119.06,43.24 121.92,40.39 | 119.06,45.72 C25.2 | 121.92,40.39 R10.1 | 102.68,52.96 102.3,52.96 IC1.30 | 104.2,54.29 103.44,54.29 102.68,53.53 | 104.2,54.29 104.58,54.29 105.54,55.24 107.06,55.24 IC1.38
  Top 0.254: 102.68,52.96 102.68,53.53 | 102.68,52.96 IC1.31 102.68,53.53 | 104.2,54.29 104.2,59.63 106.3,61.72 107.06,61.72 IC1.51 107.25,61.72 113.54,61.72 | 119.06,64.77 119.06,62.48 | 119.06,62.48 119.06,60.96 C17.2 | 119.06,72.39 119.06,68.58 | 119.06,68.58 119.06,64.77 | 119.06,64.77 C16.2 | 119.06,68.58 C12.2 | 119.06,80.01 119.06,76.2 | 119.06,80.01 119.06,83.82 C7.2 118.87,83.82 118.87,90.49 110.68,98.68 100.01,98.68 97.92,96.58 SV1.1 | 119.06,80.01 C8.2 | 119.06,76.2 119.06,72.39 | 119.06,72.39 C10.2 | 119.06,76.2 C9.2 | 113.54,61.72 114.3,62.48 119.06,62.48 | 88.01,58.1 98.11,58.1 102.68,53.53 | 156.21,12.38 156.21,16.95 | 156.21,16.95 C2.2 156.21,18.29 156.59,18.29 157.92,19.62 157.92,29.72 157.16,30.48 153.35,30.48 | 156.21,12.38 157.16,11.43 J1.2 156.21,12.38 | 156.21,12.38 152.4,8.57 J1.3 | v150.88,28.38 150.88,30.1 U2.4 | 156.21,16.95 150.69,16.95 148.59,19.05 C1.2 147.45,19.05 142.69,14.29 X1.4 142.49,14.1 136.78,8.38 128.21,8.38 | 153.35,30.48 153.35,31.05 152.21,32.19 | 153.35,30.48 153.35,30.29 U2.8 153.35,30.48 | 152.21,32.19 151.26,33.15 U2.17 | 150.88,33.34 150.88,35.81 U2.13 150.69,36.01 150.69,37.53 149.73,38.48 149.73,43.05 R6.1 | 150.88,33.34 151.07,33.15 U2.17 | C24.2 145.73,39.24 145.73,35.62 C26.2 145.54,35.43 142.49,32.38 136.59,32.38 136.4,32.19 136.4,30.1 137.92,28.57 142.88,28.57 | C3.2 148.59,23.43 147.83,23.43 144.78,26.48 R2.2 144.78,26.67 142.88,28.57 | 150.88,33.34 146.69,33.34 142.88,29.53 142.88,28.57 | 150.88,33.34 U2.17 | SV7.2 153.73,78.87 156.21,78.87 SV7.1 | SV7.8 153.73,86.49 156.21,86.49 SV7.7 | SV8.7 SV8.8 | 156.97,45.72 156.97,60.2 SV8.1 SV8.2
  Top 0.254: 152.21,32.19 156.97,36.96 156.97,45.72 | 152.21,32.19 U2.17 | 156.97,45.72 C14.2 | 43.62,54.1 43.62,57.15 C34.2 | 43.62,54.1 43.62,53.34 C32.2 43.43,53.34 43.43,5.91 42.29,4.76 SV2.1 | 43.62,54.1 46.1,54.1 46.86,53.34 C33.2 48.77,53.34 48.77,60.96 50.1,62.29 50.1,62.67 IC2.18 50.1,62.87 50.1,63.63 48.96,64.77 | 48.96,64.77 50.1,65.91 50.1,66.67 IC2.1 | 48.96,64.77 IC2.25 48.77,64.77 48.01,64.01 47.05,64.01 IC2.11 46.86,64.01 46.48,64.01 46.29,63.82 38.29,63.82 37.34,64.77 | 43.62,71.06 55.44,71.06 56.58,69.91 57.53,69.91 R14.1 | 37.34,64.77 43.62,71.06 | 37.34,64.77 R26.1 | 12.57,84.01 12.57,80.77 10.29,78.49 10.29,78.11 X2.3 | 12.57,84.01 11.05,85.53 X2.6 | 36.58,91.44 36.58,95.25 C31.2 36.39,95.25 35.62,96.01 29.72,96.01 27.43,93.73 X2.WRITE_PROT 27.24,93.53 27.24,92.39 X2.COM_TERM 27.43,92.2 27.62,92.01 27.62,90.68 X2.DETECT 27.62,90.49 21.14,84.01 12.57,84.01 | 43.62,71.06 43.62,84.39 36.58,91.44 | 36.58,91.44 C30.2 | SV6.4 SV6.6 SV6.8 75.63,3.81 74.68,4.76 | 74.68,4.76 74.68,6.86 73.34,8.19 73.34,10.1 69.91,13.53 R18.1 | 74.68,4.76 73.72,3.81 SV6.10 SV6.12 SV6.14 SV6.16 SV6.18 SV6.20 | SV3.16 SV3.14 SV3.12 SV3.10 SV3.8 100.39,3.81 101.35,4.76 | C19.2 77.53,42.29 78.87,42.29 79.63,43.05 80.39,43.05 81.15,42.29 C22.2 81.15,42.1 80.39,41.34 80.39,39.81 80.77,39.43 81.72,39.43 | 81.72,39.43 84.39,42.1 84.96,42.1 C27.2 | 96.77,13.53 96.77,14.1 95.06,15.81 95.06,51.82 95.25,52.01 95.25,52.77 IC1.16 | 96.77,13.53 97.73,12.57 98.11,12.57 99.25,11.43 99.25,8.95 101.35,6.86 101.35,4.76 | 101.35,4.76 102.3,3.81 SV3.6 SV3.4 SV3.2 108.01,3.81 109.35,2.48 115.06,2.48 116.39,3.81 LED4.C 120.59,3.81 124.97,8.19 S1.B 125.16,8.38 128.21,8.38
  Top 0.254: 81.72,39.43 81.72,37.53 89.15,30.1 89.15,13.53 89.72,12.95 96.2,12.95 96.77,13.53 | 124.21,16.19 128.02,16.19 128.21,16 128.21,8.38
  $GND 0.254: v150.88,28.38 150.88,22.48 142.69,14.29 X1.4
  Bottom 0.254: SV7.8 154.69,85.34 154.69,80.77 153.73,79.82 153.73,78.87 SV7.2 153.73,78.68 153.73,75.06 154.69,74.11 154.69,69.53 153.73,68.58 | 153.73,68.58 153.73,67.44 154.69,66.48 154.69,61.91 153.73,60.96 SV8.2 | 153.73,68.58 SV8.8 | SV6.20 60.2,4.57 42.29,4.57 SV2.1 | SV6.4 82.3,3.81 83.44,4.95 88.96,4.95 90.11,3.81 SV3.16
GPIO0_0  (via drill 0.61 layers 1-2)
  Top 0.254: v91.25,15.24 92.2,16.19 92.2,52.77 IC1.10
  $GND 0.254: v91.25,15.24 91.25,12.38 90.3,11.43 SV4.1
GPIO0_1
  Top 0.254: IC1.11 92.77,52.77 92.77,15.62 91.25,14.1 90.3,14.1 SV4.2
GPIO0_2  (1 unrouted)
GPIO0_3
  Top 0.254: IC1.13 93.73,52.77 93.73,15.05 92.77,14.1 SV4.4
GPIO0_4  (via drill 0.61 layers 1-2)
  Top 0.254: v94.49,15.24 94.3,15.43 94.3,52.77 IC1.14
  $GND 0.254: v94.49,15.24 94.49,14.67 94.11,14.29 94.11,12.57 SV4.5
GPIO0_5  (1 unrouted)
GPIO0_6
  Top 0.254: IC1.18 96.2,52.96 96.2,53.72 93.34,56.58 89.92,56.58 75.44,42.1 75.44,20.57 81.53,14.48 87.63,14.48 89.53,12.57 96.58,12.57 97.73,11.43 SV4.7
GPIO0_7
  Top 0.254: IC1.19 96.77,52.77 96.77,15.05 97.73,14.1 SV4.8
GPIO0_8  (1 unrouted)
GPIO0_9
  Top 0.254: SV4.10 97.73,16.57 97.73,52.77 IC1.21
GPIO0_10
  Top 0.254: SV4.11 101.73,12.57 101.73,14.1 98.3,17.53 98.3,52.77 IC1.22
GPIO0_11  (via drill 0.61 layers 1-2)
  Top 0.254: v104.97,55.82 104.97,59.44 106.3,60.77 107.06,60.77 IC1.49
  $GND 0.254: v104.97,55.82 103.06,55.82 102.68,55.44 102.68,14.29 102.87,14.1 SV4.12
GPIO0_12  (1 unrouted)
GPIO0_13  (1 unrouted)
GPIO0_14  (via drill 0.61 layers 1-2)
  Top 0.254: v103.44,55.05 103.44,61.15 105.54,63.25 107.06,63.25 IC1.54
  $GND 0.254: v103.44,55.05 103.44,17.53 106.87,14.1 106.87,12.38 107.82,11.43 SV4.15
GPIO0_15  (via drill 0.61 layers 1-2)
  Top 0.254: v102.68,57.53 102.68,60.96 105.54,63.82 107.06,63.82 IC1.55
  $GND 0.254: v102.68,57.53 104.39,57.53 107.82,54.1 107.82,14.1 SV4.16
GPIO1_0
  Top 0.254: IC1.56 107.25,64.2 107.82,64.2 108.97,65.34 108.97,97.73 108.39,98.3 102.3,98.3 101.35,97.35 101.35,95.25 100.78,94.68 95.25,94.68 91.63,98.3 72.77,98.3 72.39,97.92 SV5.1
GPIO1_1  (via drill 0.61 layers 1-2)
  Top 0.254: v96.39,66.48 98.11,64.77 107.06,64.77 IC1.57 | v85.92,76.39 85.92,81.72 SV5.2
  $GND 0.254: v96.39,66.48 90.87,72.01 90.3,72.01 87.25,75.06 87.25,75.63 86.49,76.39 v85.92,76.39
GPIO1_2  (via drill 0.61 layers 1-2)
  Top 0.254: v97.16,75.44 97.73,75.44 98.3,74.87 98.3,74.3 IC1.87
  $GND 0.254: v97.16,75.44 75.82,96.77 70.87,96.77 SV5.3
GPIO1_3  (via drill 0.61 layers 1-2)
  Top 0.254: v97.54,72.77 97.73,72.96 97.73,74.11 IC1.88
  $GND 0.254: v97.54,72.77 76.2,94.11 71.06,94.11 69.91,95.25 SV5.4
GPIO1_4  (1 unrouted)
GPIO1_5  (via drill 0.61 layers 1-2)
  Top 0.254: v96.39,72.77 96.77,73.15 96.77,74.11 IC1.90
  $GND 0.254: v96.39,72.77 75.44,93.73 68.96,93.73 67.44,95.25 SV5.6
GPIO1_6  (via drill 0.61 layers 1-2)
  Top 0.254: v96.01,75.44 96.2,75.25 96.2,74.3 IC1.91
  $GND 0.254: v96.01,75.44 95.44,75.44 74.49,96.39 66.1,96.39 64.77,97.73 SV5.7
GPIO1_7  (via drill 0.61 layers 1-2)
  Top 0.254: v90.49,71.25 93.73,71.25 95.82,73.34 95.82,74.11 IC1.92 | v86.49,75.25 84.77,75.25 SV5.8
  $GND 0.254: v86.49,75.25 v90.49,71.25
GPIO1_8  (via drill 0.61 layers 1-2)
  Top 0.254: v88.58,72.01 93.92,72.01 95.25,73.34 95.25,74.11 IC1.93 | v86.49,74.11 84.39,74.11 63.25,95.25 63.25,96.77 SV5.9
  $GND 0.254: v86.49,74.11 v88.58,72.01
GPIO1_9
  Top 0.254: IC1.124 85.72,64.77 75.06,64.77 60.96,78.87 60.96,94.11 62.1,95.25 SV5.10
GPIO1_10  (1 unrouted)
GPIO1_11
  Top 0.254: IC1.126 85.72,63.82 75.44,63.82 59.82,79.44 59.82,95.25 SV5.12
GPIO1_12
  Top 0.254: IC1.127 85.72,63.25 75.44,63.25 58.29,80.39 58.29,96.58 57.15,97.73 SV5.13
GPIO1_13  (1 unrouted)
GPIO1_14  (via drill 0.61 layers 1-2)
  Top 0.254: v61.72,91.63 79.63,73.72 85.72,73.72 86.87,72.58 86.87,62.48 86.68,62.29 85.92,62.29 IC1.129
  $GND 0.254: v61.72,91.63 58.29,95.06 58.29,95.63 57.15,96.77 55.63,96.77 SV5.15
GPIO1_15
  Top 0.254: IC1.132 85.72,60.77 77.34,60.77 54.67,83.44 54.67,95.25 SV5.16
I2C_GP0  (1 unrouted)
I2C_GP1  (via drill 0.61 layers 1-2)
  Top 0.254: v79.25,59.44 79.44,59.24 85.72,59.24 IC1.135 | v50.67,60.77 50.67,60.2 49.53,59.05 49.53,16.95 43.81,11.24 43.81,3.81 42.67,2.67 41.72,2.67 39.81,4.57 SV2.2
  $GND 0.254: v79.25,59.44 78.68,59.44 77.34,60.77 v50.67,60.77
INT_GYRO  (1 unrouted)
JTCK  (via drill 0.61 layers 1-2)
  Top 0.254: SV6.9 69.91,10.1 69.91,11.81 R18.2 69.72,12 68.96,12.76 55.05,12.76 54.86,12.95 54.86,42.86 69.34,57.34 v69.34,67.63 | v73.72,72.01 74.49,72.77 84.01,72.77 84.39,72.39 85.72,72.39 IC1.109
  $GND 0.254: v69.34,67.63 v73.72,72.01
JTDI  (via drill 0.61 layers 1-2, 0.61 layers 15-16, 0.61 layers 2-15)
  Top 0.254: R16.2 77.53,11.81 77.53,7.62 78.68,6.48 SV6.5 | v83.63,72.01 83.82,71.82 85.72,71.82 IC1.110
  $GND 0.254: v83.63,69.72 v83.63,72.01
  $VDD 0.254: v82.87,68.96 v83.63,69.72
  Bottom 0.254: v82.87,68.96 82.87,10.48 SV6.5
JTDO  (via drill 0.61 layers 1-2)
  Top 0.254: R19.2 66.1,11.81 66.1,8.95 68.58,6.48 SV6.13 | v61.15,48.01 73.34,60.2 85.72,60.2 IC1.133
  $GND 0.254: v61.15,48.01 61.15,13.91 68.58,6.48 SV6.13
JTMS  (1 unrouted)
  Top 0.254: R17.2 73.72,11.81 73.72,8.95 76.2,6.48 SV6.7
JTNRST  (via drill 0.61 layers 1-2, 0.61 layers 15-16, 0.61 layers 2-15)
  Top 0.254: R15.2 81.34,11.81 81.34,6.48 SV6.3 | v87.25,58.48 87.25,59.24 86.68,59.82 85.92,59.82 IC1.134
  $GND 0.254: v87.25,56.58 v87.25,58.48
  $VDD 0.254: v86.49,55.82 v87.25,56.58
  Bottom 0.254: v86.49,55.82 86.49,11.62 81.34,6.48 SV6.3
LED1  (via drill 0.61 layers 1-2)
  Top 0.254: v90.3,55.82 89.72,55.82 88.77,54.86 88.77,52.96 IC1.3 | v51.82,59.63 51.82,18.67 47.82,14.67 47.82,8.19 50.86,5.14 54.67,5.14 56.01,3.81 LED1.C
  $GND 0.254: v90.3,55.82 81.72,55.82 77.92,59.63 v51.82,59.63
LED2  (1 unrouted)
LED3  (via drill 0.61 layers 1-2)
  Top 0.254: v89.72,54.67 89.72,52.96 IC1.5 | v84.39,54.86 69.15,54.86 56.2,41.91 56.2,14.1 LED3.C
  $GND 0.254: v89.72,54.67 84.58,54.67 v84.39,54.86
N$1  (via drill 0.61 layers 1-2)  (1 unrouted)
  Top 0.254: v74.68,37.15 73.53,36.01 70.48,36.01 R11.2 | C19.1 77.34,40.39 76.2,39.24 v76.2,38.67 76.2,32.77 Q1.2
  $GND 0.254: v76.2,38.67 v74.68,37.15
N$2  (via drill 0.61 layers 1-2)
  Top 0.254: v99.06,51.44 99.25,51.63 99.25,52.77 IC1.24 | v74.68,39.43 73.72,40.39 C20.1 73.53,40.39 70.87,37.72 70.48,37.72 R11.1 70.48,37.53 69.53,36.58 69.53,35.43 70.1,34.86 Q1.1
  $GND 0.254: v99.06,51.44 96.97,51.44 84.96,39.43 v74.68,39.43
N$3  (1 unrouted)
N$4  (via drill 0.61 layers 1-2)
  Top 0.254: 72.77,47.62 72.77,41.53 67.06,35.81 67.06,23.43 70.1,20.38 Q2.1 | 72.77,47.62 72.77,48.77 C29.1 | v84.77,49.15 89.15,49.15 91.25,51.24 91.25,52.77 IC1.8 | 72.77,47.62 v73.91,47.62
  $GND 0.254: v84.77,49.15 75.44,49.15 v73.91,47.62
N$5  (via drill 0.61 layers 1-2)
  Top 0.254: v83.82,53.34 69.72,53.34 65.34,48.96 C28.1 | v90.87,54.29 91.25,54.29 91.82,53.72 91.82,52.96 IC1.9 | v80.01,42.29 80.01,38.67 82.68,36.01 82.68,28 79.82,25.15 79.82,20.38 Q2.2
  $GND 0.254: v90.87,54.29 90.49,53.91 89.34,53.91 89.15,54.1 84.58,54.1 v83.82,53.34 85.53,51.63 85.53,48.77 80.01,43.24 v80.01,42.29
N$6
  Top 0.254: IC1.104 89.72,74.3 89.72,91.06 87.06,93.73 87.06,94.3 U3.D+1
N$7
  Top 0.254: 123.25,14.48 122.49,15.24 C6.1 | 123.25,14.48 126.49,14.48 127.25,15.24 R5.1 | 123.25,14.48 121.35,12.57 121.35,7.05 S1.A1
N$8
  Top 0.254: R23.1 114.68,8.76 114.68,4.19 114.3,3.81 LED4.A
N$9
  Top 0.254: LED1.A R20.1
N$10
  Top 0.254: IC2.23 51.05,65.53 52.77,65.53 54.67,63.63 54.67,63.44 55.44,62.67 55.82,62.67 R24.2
N$12
  Top 0.254: IC2.24 51.05,66.1 52.77,66.1 55.05,63.82 55.05,63.63 55.24,63.44 58.86,63.44 59.63,62.67 R25.2
N$13
  Top 0.254: R21.1 50.48,8.95 53.15,8.95 LED2.A
N$14
  Top 0.254: C5.2 152.4,24 152.02,24.38 151.83,24.38 149.54,26.67 149.54,30.1 U2.2
N$15
  Top 0.254: IC2.12 46.86,63.44 41.53,63.44 39.05,60.96 R27.2
N$16  (1 unrouted)
N$17
  Top 0.254: IC2.20 51.05,64.01 51.44,64.01 51.63,63.82 51.63,60.58 50.48,59.44 50.48,53.34 C33.1
N$18
  Top 0.254: 44.96,64.96 39.24,64.96 39.05,64.77 R26.2 | 44.96,64.96 46.86,64.96 IC2.9 | 44.96,64.96 44.96,66.1 46.29,67.44 50.48,67.44 51.44,66.48 52.96,66.48 53.91,67.44 57.15,67.44 58.86,69.15 58.86,69.34 59.24,69.72 R14.2
N$19
  Top 0.254: R22.1 50.48,14.1 53.15,14.1 LED3.A
N$20
  Top 0.254: C15.2 145.73,43.05 145.73,41.91 149.54,38.1 149.54,36.01 U2.15
N$21  (via drill 0.61 layers 1-2)
  Top 0.254: 152.59,25.53 150.11,28 150.11,30.1 U2.3 | 152.59,25.53 154.11,24 C5.1 | v151.07,21.53 148.78,21.53 147.07,19.81 138.49,19.81 L1.2 | 152.59,25.53 v152.21,25.15
  $GND 0.254: v151.07,21.53 151.07,22.1 152.21,23.24 v152.21,25.15
N$22
  Top 0.254: U1.4 130.68,26.29 130.68,25.91 128.59,23.81 125.16,23.81 124.21,22.86 R3.2
N$23
  Top 0.254: 148.21,35.43 148.21,35.05 148.59,34.67 149.73,34.67 150.11,35.05 150.11,35.81 U2.14 | 148.21,35.43 148.21,38.29 144.02,42.48 144.02,43.05 C15.1 | 148.21,35.43 144.02,31.24 138.49,31.24 L2.1
N$24
  Top 0.254: R4.2 128.21,22.86 131.25,25.91 131.25,26.29 U1.5
N$25
  Top 0.254: R9.1 129.54,38.48 131.25,36.77 131.25,30.86 U1.6 131.25,30.67 131.25,30.29 130.87,29.91 128.97,29.91 121.92,36.96 R10.2
N$26
  Top 0.254: R1.2 156.21,29.34 156.02,29.15 153.16,29.15 152.78,29.53 152.78,30.1 U2.7 152.78,30.29 152.78,30.86 152.21,31.43 148.78,31.43 146.88,29.53 144.78,29.53 R2.1
N$27
  Top 0.254: U1.7 130.68,30.86 130.68,33.15 129.16,34.67 128.21,34.67 126.68,36.2 126.68,36.77 R7.2 126.49,36.96 125.73,37.72 C13.1
N$28
  Top 0.254: U2.10 152.78,36.01 152.78,42.86 152.59,43.05 R6.2 152.59,43.24 152.59,48.2 R8.1
N$30
  Top 0.254: C14.1 155.26,45.72 155.26,37.91 153.35,36.01 U2.9
NRST  (via drill 0.61 layers 1-2)
  Top 0.254: v119.44,15.24 99.82,34.86 99.82,52.77 IC1.25
  $GND 0.254: v119.44,15.24 127.64,7.05 S1.A
  Bottom 0.254: S1.A 127.25,5.33 68.01,5.33 67.06,6.29 66.1,6.29 SV6.15
PWM0_0  (via drill 0.61 layers 1-2)
  Top 0.254: v116.78,59.05 116.01,59.82 107.25,59.82 IC1.47 | v119.83,62.1 124.21,62.1 153.54,91.44 SV7.12
  $GND 0.254: v119.83,62.1 v116.78,59.05
PWM0_1  (via drill 0.61 layers 1-2)
  Top 0.254: v112.01,59.05 111.82,59.24 107.25,59.24 IC1.46 | v119.83,63.25 124.02,63.25 153.35,92.58 155.07,92.58 SV7.11
  $GND 0.254: v112.01,59.05 112.78,58.29 114.87,58.29 v119.83,63.25
PWM0_2  (1 unrouted)
PWM0_3  (via drill 0.61 layers 1-2)
  Top 0.254: v116.01,56.77 107.25,56.77 IC1.41 | v119.06,59.82 130.68,59.82 153.54,82.68 155.07,82.68 SV7.5
  $GND 0.254: v119.06,59.82 v116.01,56.77
PWM1_0  (1 unrouted)
PWM1_1  (via drill 0.61 layers 1-2)
  Top 0.254: v107.25,75.06 100.97,75.06 100.78,74.87 100.78,74.3 IC1.82
  $GND 0.254: v107.25,75.06 154.88,75.06 156.21,73.72 SV8.11
PWM1_2  (via drill 0.61 layers 1-2)
  Top 0.254: v99.63,72.77 99.25,73.15 99.25,74.11 IC1.85
  $GND 0.254: v99.63,72.77 146.88,72.77 153.54,66.1 SV8.6
PWM1_3  (1 unrouted)
RX  (1 unrouted)
SCL  (1 unrouted)
SCL_GYRO  (via drill 0.61 layers 1-2)  (1 unrouted)
  Top 0.254: v51.82,68.58 50.67,69.72 49.15,69.72 R12.2 | v54.29,66.67 54.29,65.91 55.82,64.39 R24.1
  $GND 0.254: v51.82,68.58 52.39,68.58 v54.29,66.67
SDA  (via drill 0.61 layers 1-2, 0.61 layers 2-15)
  Top 0.254: v80.77,55.63 83.44,58.29 85.72,58.29 IC1.137
  $GND 0.254: v80.77,55.63 70.67,45.53 v70.67,40.77
  $VDD 0.254: v70.67,40.77 34.67,4.76 SV2.4
SDA_GYRO  (via drill 0.61 layers 1-2)
  Top 0.254: 60.2,66.86 60.2,64.77 59.82,64.39 R25.1 | 60.2,66.86 60.2,70.48 60.01,70.67 58.67,70.67 58.48,70.48 58.48,69.34 58.1,68.96 56.96,68.96 56.2,69.72 54.29,69.72 R13.2 | v88.01,68.96 92.58,68.96 94.87,71.25 107.06,71.25 IC1.70 | 60.2,66.86 v68.39,66.86
  $GND 0.254: v88.01,68.96 71.82,68.96 69.72,66.86 v68.39,66.86
SDIO_CK  (via drill 0.61 layers 1-2)
  Top 0.254: v76.39,70.48 76.58,70.29 85.72,70.29 IC1.113 | v64.2,72.77 60.39,72.77 36.77,96.39 16.76,96.39 11.05,90.68 9.53,90.68 9.34,90.49 9.34,84.77 10.86,83.25 X2.5
  $GND 0.254: v76.39,70.48 74.11,72.77 v64.2,72.77
SDIO_CMD  (via drill 0.61 layers 1-2)
  Top 0.254: 36.39,73.91 36.39,76.2 R29.2 | 36.39,73.91 35.62,73.15 35.62,71.82 35.24,71.44 15.43,71.44 11.43,75.44 11.05,75.44 X2.2 | v70.48,70.48 72.2,68.77 85.72,68.77 IC1.116 | 36.39,73.91 v36.58,73.72
  $GND 0.254: v70.48,70.48 39.81,70.48 v36.58,73.72
SDIO_D0  (via drill 0.61 layers 1-2)
  Top 0.254: v35.43,82.49 36.39,81.53 36.39,80.01 R30.2 | v24,88.01 11.05,88.01 X2.7 | v92.58,75.44 92.77,75.25 92.77,74.3 IC1.98
  $GND 0.254: v24,88.01 29.53,82.49 v35.43,82.49 81.53,82.49 88.58,75.44 v92.58,75.44
SDIO_D1  (via drill 0.61 layers 1-2)
  Top 0.254: v35.43,85.15 36.39,84.2 36.39,83.82 R31.2 | v25.53,89.53 11.05,89.53 X2.8 | v90.68,72.77 91.63,72.77 92.2,73.34 92.2,74.11 IC1.99
  $GND 0.254: v35.43,85.15 29.91,85.15 v25.53,89.53 24.38,89.53 23.24,88.39 23.24,87.63 29.15,81.72 81.72,81.72 v90.68,72.77
SDIO_D2  (via drill 0.61 layers 1-2)
  Top 0.254: 37.34,79.25 37.34,71.82 36.2,70.67 8.76,70.67 X2.9 | 37.34,79.25 37.34,84.39 36.58,85.15 36.58,87.63 R32.2 | v61.72,79.25 69.72,71.25 85.72,71.25 IC1.111 | 37.34,79.25 v42.86,79.25
  $GND 0.254: v42.86,79.25 v61.72,79.25
SDIO_D3  (1 unrouted)
  Top 0.254: R28.2 36.39,72.39 36.39,72.01 35.43,71.06 13.53,71.06 11.62,72.96 X2.1
TX
  Top 0.254: IC1.101 91.25,74.3 91.25,82.3 105.35,96.39 SV1.4
USART_GP  (via drill 0.61 layers 1-2)
  Top 0.254: v113.16,59.05 111.82,57.72 107.25,57.72 IC1.43
  $GND 0.254: v113.16,59.05 115.44,61.34 115.44,62.1 105.54,72.01 99.25,72.01 98.87,72.39 98.87,95.06 SV1.2
VCC  (via drill 0.61 layers 1-2)  (1 unrouted)
  Top 0.254: R12.1 47.43,69.91 48.2,70.67 51.63,70.67 52.39,69.91 R13.1 52.58,69.72 v52.58,67.25 | 57.15,2.86 56.77,2.48 50.1,2.48 48.77,3.81 R20.2 | 57.15,2.86 57.15,4.76 54.29,7.62 49.91,7.62 48.77,8.76 R21.2 48.77,8.95 48.77,13.91 R22.2 48.77,14.1 52.58,17.91 v52.58,64.58 | SV3.7 100.2,6.48 97.92,6.48 SV3.9 97.73,6.48 95.25,6.48 | 95.25,6.48 92.77,6.48 SV3.13 92.58,6.48 90.3,6.48 SV3.15 86.49,2.67 60.58,2.67 60.39,2.86 57.15,2.86 | 95.25,6.48 SV3.11 | U1.3 130.11,26.48 129.73,26.48 U1.2 129.54,26.48 129.16,26.48 U1.1 129.16,26.29 125.16,26.29 124.78,25.91 122.3,25.91 | 122.3,25.91 122.3,26.67 C4.1 | 122.3,25.91 122.3,22.86 | SV3.5 102.87,6.48 105.35,6.48 SV3.3 105.54,6.48 107.82,6.48 SV3.1 108.01,6.48 111.25,9.72 115.25,9.72 | 115.25,9.72 115.63,9.72 116.39,8.95 R23.2 | 122.3,22.86 122.3,16.76 115.25,9.72 | 122.3,22.86 R3.1 | 142.69,35.43 139.06,35.43 136.02,32.38 136.02,29.72 138.3,27.43 L2.2 138.49,27.24 142.3,23.43 142.3,22.1 141.92,21.72 137.35,21.72 135.64,20 135.64,14.29 X1.1 | 142.69,35.43 143.83,35.43 C26.1 | SV7.3 156.21,81.34 153.73,81.34 SV7.4 153.54,81.15 153.54,80.2 152.59,79.25 152.59,72.2 SV8.10 | SV7.10 153.73,88.96 156.21,88.96 SV7.9 | SV8.10 153.73,71.25 156.21,71.25 SV8.9 | SV8.4 153.54,63.44 149.73,59.63 149.73,48.39 R8.2 149.54,48.2 146.88,48.2 142.69,44.01 142.69,35.43 | SV8.3 156.21,63.63 153.73,63.63 SV8.4 | SV8.4 152.59,64.58 152.59,68.96 153.54,69.91 153.54,71.06 SV8.10
  $GND 0.254: v52.58,64.58 v52.58,67.25
  Bottom 0.254: SV3.7 100.39,6.48 102.87,6.48 SV3.5 | SV7.10 152.59,87.82 152.59,83.44 153.54,82.49 153.54,81.34 SV7.4 | SV3.1 108.01,6.48 119.44,6.48 127.06,14.1 135.45,14.1 X1.1
VDD  (via drill 0.61 layers 1-2)  (1 unrouted)
  Top 0.254: R1.1 156.21,22.29 | 156.21,22.29 C2.1 | 137.92,24 138.3,23.62 L1.1 | 137.92,24 135.64,26.29 135.64,41.91 117.35,60.2 117.35,60.96 C17.1 115.44,60.96 v114.68,61.72 | 137.92,24 129.16,15.24 R5.2 | 137.92,24 L1.1 | v143.06,22.29 156.21,22.29 | v141.54,22.48 139.45,22.48 138.49,23.43 L1.1 | 117.35,80.01 117.35,83.82 C7.1 117.16,83.82 110.49,90.49 SV1.6 | 117.35,76.2 117.35,72.39 | 117.35,68.58 117.35,64.77 C16.1 116.01,64.77 113.54,62.29 107.25,62.29 IC1.52 107.06,62.29 105.73,62.29 v104.2,60.77 | 117.35,68.58 117.35,72.39 | 117.35,72.39 C10.1 | 117.35,68.58 C12.1 | 117.35,76.2 117.35,80.01 | 117.35,80.01 C8.1 | 117.35,76.2 C9.1 | 108.2,55.44 107.82,55.82 107.25,55.82 IC1.39 | 108.2,55.44 108.2,54.48 107.63,53.91 104.01,53.91 103.82,53.72 103.82,52.96 IC1.33 103.63,52.96 103.44,52.96 IC1.32 103.25,52.77 103.25,52.01 102.68,51.44 v100.58,51.44 | 117.35,49.53 117.35,45.72 C25.1 | 117.35,55.44 117.35,57.15 C18.1 | 117.35,55.44 117.35,53.34 | 117.35,53.34 117.35,49.53 | 117.35,49.53 C23.1 | 117.35,53.34 C21.1 | 117.35,55.44 108.2,55.44 | 108.01,72.2 108.2,72.01 108.2,67.44 108.01,67.25 107.25,67.25 IC1.62 107.06,67.25 88.58,67.25 v88.01,67.82 | 108.01,72.2 107.25,72.2 IC1.72 | 99.63,75.06 99.82,74.87 99.82,74.3 IC1.84 | 99.63,75.06 98.49,76.2 95.63,76.2 94.3,74.87 94.3,74.3 IC1.95 | 108.01,72.2 108.01,75.44 107.63,75.82 100.39,75.82 99.63,75.06 | 84.58,43.05 82.11,40.58 81.34,40.58 C22.1 | 84.58,43.05 85.72,43.05 85.92,42.86 85.92,41.34 85.15,40.58 C27.1 | 89.72,51.44 88.2,49.91 84.39,49.91 84.01,49.53 84.01,43.62 84.58,43.05 | 89.72,51.44 90.3,52.01 90.3,52.77 IC1.6 | v95.82,51.44 95.82,52.77 IC1.17
  Top 0.254: 89.72,51.44 v90.3,51.44 | IC1.144 85.72,54.67 85.72,54.1 v84.96,53.34 84.2,54.1 68.96,54.1 64.2,49.34 64.2,15.43 65.91,13.72 R19.1 66.1,13.72 68.58,13.72 69.34,14.48 72.77,14.48 73.53,13.72 R17.1 73.72,13.72 77.34,13.72 R16.1 77.53,13.72 81.15,13.72 R15.1 81.34,13.53 83.82,11.05 SV6.1 SV6.2 | v84.39,65.53 85.15,66.29 85.72,66.29 IC1.121 | v88.01,70.48 87.82,70.67 87.82,74.11 IC1.108 | 34.67,87.63 34.67,91.44 C30.1 34.86,91.44 34.86,95.25 C31.1 | 34.67,76.2 34.67,72.39 R28.1 | 34.67,83.82 34.67,80.01 | 34.67,80.01 34.67,77.15 | 34.67,77.15 34.67,76.2 | 34.67,76.2 R29.1 | 34.67,80.01 R30.1 | 8.76,77.15 8.38,77.53 8.38,78.68 10.1,80.39 X2.4 | 34.67,77.15 8.76,77.15 | 34.67,83.82 34.67,87.63 | 34.67,87.63 R32.1 | 34.67,83.82 R31.1 | 8.76,77.15 8.76,72.96 5.91,70.1 5.91,28.38 29.53,4.76 SV2.6
  $GND 0.254: v143.06,22.29 141.73,22.29 v141.54,22.48 | 91.63,51.44 v90.3,51.44 88.39,53.34 v84.96,53.34 | 91.63,51.44 v95.82,51.44 96.58,52.2 99.44,52.2 | 91.63,51.44 91.63,55.63 84.39,62.87 v84.39,65.53 85.72,65.53 v88.01,67.82 88.77,68.58 88.77,69.34 88.01,70.1 v88.01,70.48 | v100.58,51.44 100.2,51.44 99.44,52.2 | 99.44,52.2 99.44,55.44 104.2,60.2 v104.2,60.77 105.16,61.72 v114.68,61.72
  Bottom 0.254: SV6.2 82.68,2.67 31.62,2.67 29.72,4.57 SV2.6
VEE  (via drill 0.61 layers 1-2)
  Top 0.254: 47.62,62.67 47.62,59.44 45.34,57.15 C34.1 | v45.72,65.72 45.91,65.53 46.86,65.53 IC2.8 | 47.62,62.67 v46.67,62.67 | 47.62,62.67 IC2.13 | U1.9 129.54,30.67 129.16,30.67 U1.10 129.16,30.86 129.16,32.96 v128.59,33.53 126.68,33.53 124.02,36.2 124.02,37.91 122.49,39.43 121.35,39.43 118.3,36.39 v100.58,36.39 | v128.59,35.43 128.59,39.24 129.54,40.2 R9.2 | v132.21,40.2 133.35,40.2 C11.1
  $GND 0.254: v45.72,65.72 45.72,63.63 v46.67,62.67 47.62,62.67 73.91,36.39 v100.58,36.39 | v128.59,33.53 v128.59,35.43 132.21,39.05 v132.21,40.2